# EAGLE design TelemetryECU rev1 (EAGLE 9.1.3)
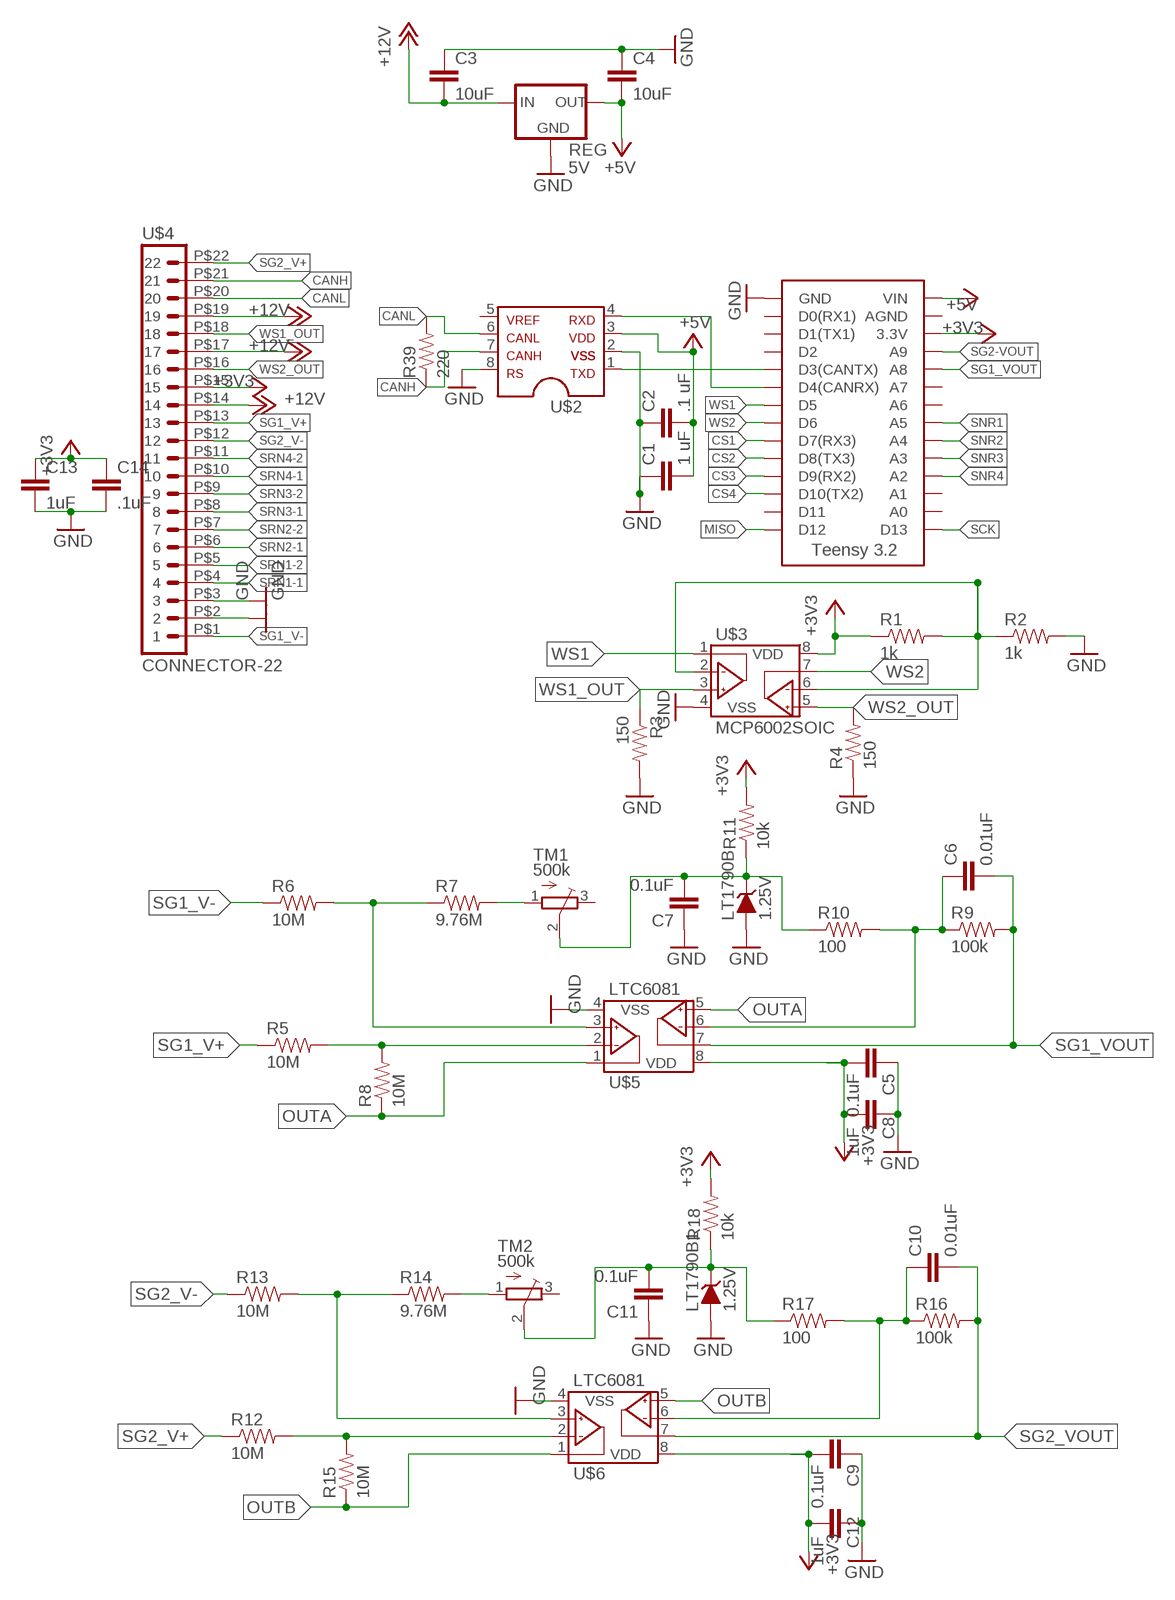
[diagram p0: schematic, sheet 1, part 1 of 2]
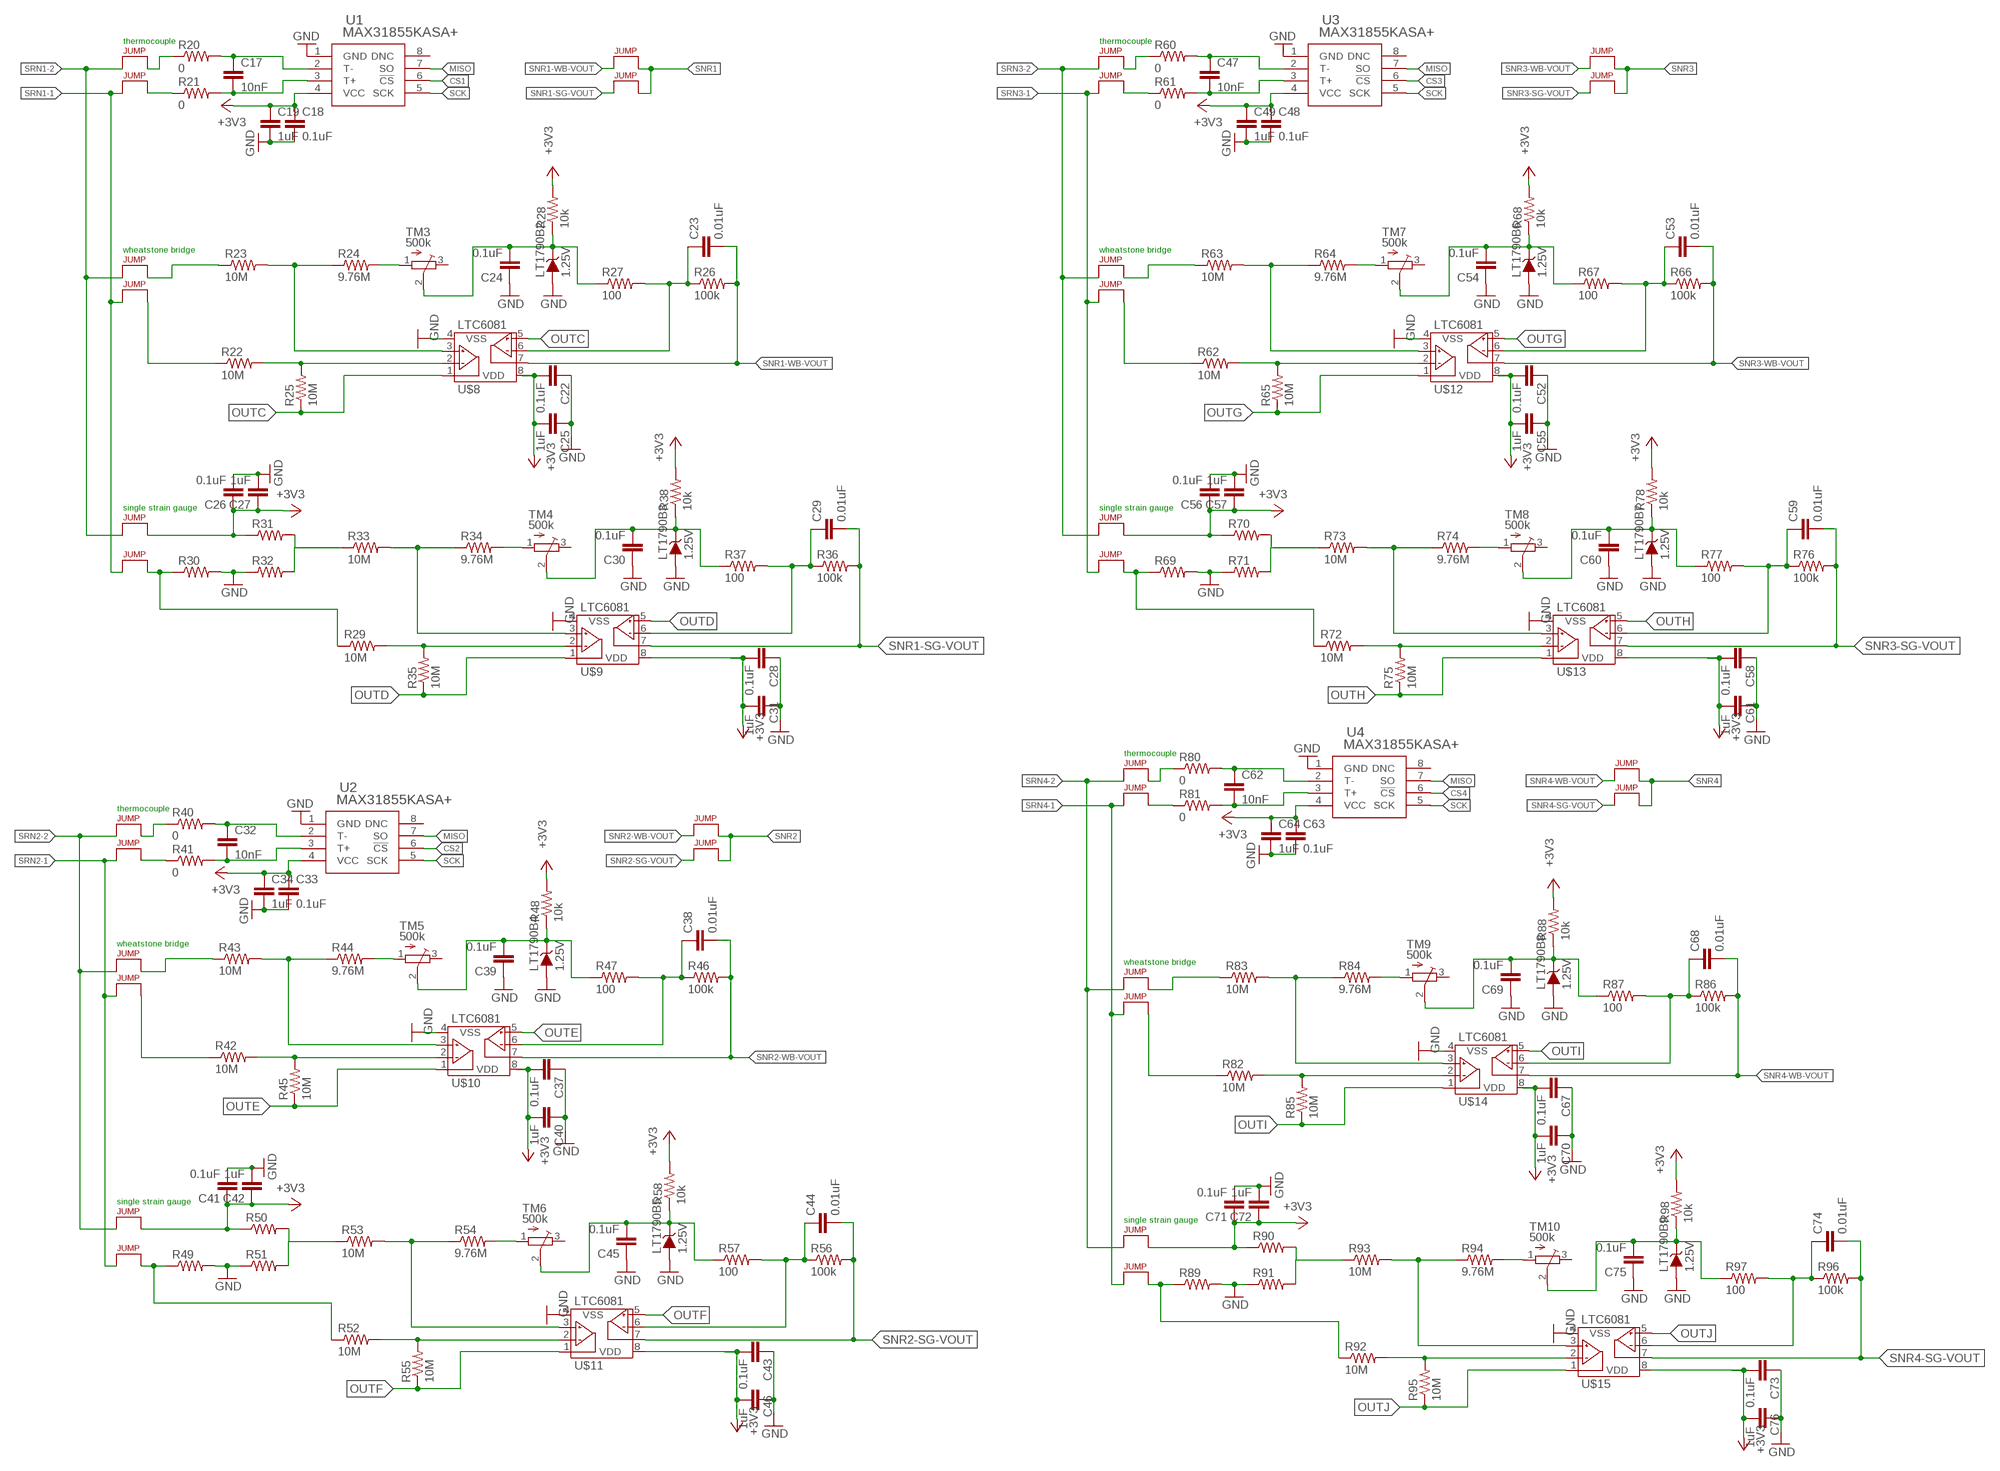
[diagram p1: schematic, sheet 1, part 2 of 2]

## Parts
C1  1 uF  CAP0603-CAP  [0603-CAP]
C2  .1 uF  CAP0603-CAP  [0603-CAP]
C3  10uF  CAP0603-CAP  [0603-CAP]
C4  10uF  CAP0603-CAP  [0603-CAP]
C5  0.1uF  CAP0603-CAP  [0603-CAP]
C6  0.01uF  CAP0603-CAP  [0603-CAP]
C7  0.1uF  CAP0603-CAP  [0603-CAP]
C8  1uF  CAP0603-CAP  [0603-CAP]
C9  0.1uF  CAP0603-CAP  [0603-CAP]
C10  0.01uF  CAP0603-CAP  [0603-CAP]
C11  0.1uF  CAP0603-CAP  [0603-CAP]
C12  1uF  CAP0603-CAP  [0603-CAP]
C13  1uF  CAP0603-CAP  [0603-CAP]
C14  .1uF  CAP0603-CAP  [0603-CAP]
C17  10nF  CAP0603-CAP  [0603-CAP]
C18  0.1uF  CAP0603-CAP  [0603-CAP]
C19  1uF  CAP0603-CAP  [0603-CAP]
C22  0.1uF  CAP0805  [0805]
C23  0.01uF  CAP0805  [0805]
C24  0.1uF  CAP0805  [0805]
C25  1uF  CAP0805  [0805]
C26  0.1uF  CAP0603-CAP  [0603-CAP]
C27  1uF  CAP0603-CAP  [0603-CAP]
C28  0.1uF  CAP0805  [0805]
C29  0.01uF  CAP0805  [0805]
C30  0.1uF  CAP0805  [0805]
C31  1uF  CAP0805  [0805]
C32  10nF  CAP0603-CAP  [0603-CAP]
C33  0.1uF  CAP0603-CAP  [0603-CAP]
C34  1uF  CAP0603-CAP  [0603-CAP]
C37  0.1uF  CAP0805  [0805]
C38  0.01uF  CAP0805  [0805]
C39  0.1uF  CAP0805  [0805]
C40  1uF  CAP0805  [0805]
C41  0.1uF  CAP0603-CAP  [0603-CAP]
C42  1uF  CAP0603-CAP  [0603-CAP]
C43  0.1uF  CAP0805  [0805]
C44  0.01uF  CAP0805  [0805]
C45  0.1uF  CAP0805  [0805]
C46  1uF  CAP0805  [0805]
C47  10nF  CAP0603-CAP  [0603-CAP]
C48  0.1uF  CAP0603-CAP  [0603-CAP]
C49  1uF  CAP0603-CAP  [0603-CAP]
C52  0.1uF  CAP0805  [0805]
C53  0.01uF  CAP0805  [0805]
C54  0.1uF  CAP0805  [0805]
C55  1uF  CAP0805  [0805]
C56  0.1uF  CAP0603-CAP  [0603-CAP]
C57  1uF  CAP0603-CAP  [0603-CAP]
C58  0.1uF  CAP0805  [0805]
C59  0.01uF  CAP0805  [0805]
C60  0.1uF  CAP0805  [0805]
C61  1uF  CAP0805  [0805]
C62  10nF  CAP0603-CAP  [0603-CAP]
C63  0.1uF  CAP0603-CAP  [0603-CAP]
C64  1uF  CAP0603-CAP  [0603-CAP]
C67  0.1uF  CAP0805  [0805]
C68  0.01uF  CAP0805  [0805]
C69  0.1uF  CAP0805  [0805]
C70  1uF  CAP0805  [0805]
C71  0.1uF  CAP0603-CAP  [0603-CAP]
C72  1uF  CAP0603-CAP  [0603-CAP]
C73  0.1uF  CAP0805  [0805]
C74  0.01uF  CAP0805  [0805]
C75  0.1uF  CAP0805  [0805]
C76  1uF  CAP0805  [0805]
J1  JUMPER.1  [1X02]
J2  JUMPER.1  [1X02]
J5  JUMPER.1  [1X02]
J6  JUMPER.1  [1X02]
J7  JUMPER.1  [1X02]
J8  JUMPER.1  [1X02]
J9  JUMPER.1  [1X02]
J10  JUMPER.1  [1X02]
J13  JUMPER.1  [1X02]
J14  JUMPER.1  [1X02]
J15  JUMPER.1  [1X02]
J16  JUMPER.1  [1X02]
J17  JUMPER.1  [1X02]
J18  JUMPER.1  [1X02]
J21  JUMPER.1  [1X02]
J22  JUMPER.1  [1X02]
J23  JUMPER.1  [1X02]
J24  JUMPER.1  [1X02]
J25  JUMPER.1  [1X02]
J26  JUMPER.1  [1X02]
J29  JUMPER.1  [1X02]
J30  JUMPER.1  [1X02]
J31  JUMPER.1  [1X02]
J32  JUMPER.1  [1X02]
J34  JUMPER.1  [1X02]
J35  JUMPER.1  [1X02]
J37  JUMPER.1  [1X02]
J38  JUMPER.1  [1X02]
J40  JUMPER.1  [1X02]
J41  JUMPER.1  [1X02]
J42  JUMPER.1  [1X02]
J43  JUMPER.1  [1X02]
LT1790B  1.25V  DIODE_ZENER0805  [0805_D]
LT1790B1  1.25V  DIODE_ZENER0805  [0805_D]
LT1790B2  1.25V  DIODE_ZENER0805  [0805_D]
LT1790B3  1.25V  DIODE_ZENER0805  [0805_D]
LT1790B4  1.25V  DIODE_ZENER0805  [0805_D]
LT1790B5  1.25V  DIODE_ZENER0805  [0805_D]
LT1790B6  1.25V  DIODE_ZENER0805  [0805_D]
LT1790B7  1.25V  DIODE_ZENER0805  [0805_D]
LT1790B8  1.25V  DIODE_ZENER0805  [0805_D]
LT1790B9  1.25V  DIODE_ZENER0805  [0805_D]
R1  1k  RESISTOR0603-RES  [0603-RES]
R2  1k  RESISTOR0603-RES  [0603-RES]
R3  150  RESISTOR0603-RES  [0603-RES]
R4  150  RESISTOR0603-RES  [0603-RES]
R5  10M  RESISTOR0603-RES  [0603-RES]
R6  10M  RESISTOR0603-RES  [0603-RES]
R7  9.76M  RESISTOR0603-RES  [0603-RES]
R8  10M  RESISTOR0603-RES  [0603-RES]
R9  100k  RESISTOR0603-RES  [0603-RES]
R10  100  RESISTOR0603-RES  [0603-RES]
R11  10k  RESISTOR0603  [0603-RES]
R12  10M  RESISTOR0603-RES  [0603-RES]
R13  10M  RESISTOR0603-RES  [0603-RES]
R14  9.76M  RESISTOR0603-RES  [0603-RES]
R15  10M  RESISTOR0603-RES  [0603-RES]
R16  100k  RESISTOR0603-RES  [0603-RES]
R17  100  RESISTOR0603-RES  [0603-RES]
R18  10k  RESISTOR0603-RES  [0603-RES]
R20  0  RESISTOR0603  [0603-RES]
R21  0  RESISTOR0603  [0603-RES]
R22  10M  RESISTOR0805-RES  [0805]
R23  10M  RESISTOR0805-RES  [0805]
R24  9.76M  RESISTOR0805-RES  [0805]
R25  10M  RESISTOR0805-RES  [0805]
R26  100k  RESISTOR0805-RES  [0805]
R27  100  RESISTOR0805-RES  [0805]
R28  10k  RESISTOR0805-RES  [0805]
R29  10M  RESISTOR0805-RES  [0805]
R30  RESISTOR0603  [0603-RES]
R31  RESISTOR0603  [0603-RES]
R32  RESISTOR0603  [0603-RES]
R33  10M  RESISTOR0805-RES  [0805]
R34  9.76M  RESISTOR0805-RES  [0805]
R35  10M  RESISTOR0805-RES  [0805]
R36  100k  RESISTOR0805-RES  [0805]
R37  100  RESISTOR0805-RES  [0805]
R38  10k  RESISTOR0805-RES  [0805]
R39  220  RESISTOR0603-RES  [0603-RES]
R40  0  RESISTOR0603  [0603-RES]
R41  0  RESISTOR0603  [0603-RES]
R42  10M  RESISTOR0805-RES  [0805]
R43  10M  RESISTOR0805-RES  [0805]
R44  9.76M  RESISTOR0805-RES  [0805]
R45  10M  RESISTOR0805-RES  [0805]
R46  100k  RESISTOR0805-RES  [0805]
R47  100  RESISTOR0805-RES  [0805]
R48  10k  RESISTOR0805-RES  [0805]
R49  RESISTOR0603  [0603-RES]
R50  RESISTOR0603  [0603-RES]
R51  RESISTOR0603  [0603-RES]
R52  10M  RESISTOR0805-RES  [0805]
R53  10M  RESISTOR0805-RES  [0805]
R54  9.76M  RESISTOR0805-RES  [0805]
R55  10M  RESISTOR0805-RES  [0805]
R56  100k  RESISTOR0805-RES  [0805]
R57  100  RESISTOR0805-RES  [0805]
R58  10k  RESISTOR0805-RES  [0805]
R60  0  RESISTOR0603  [0603-RES]
R61  0  RESISTOR0603  [0603-RES]
R62  10M  RESISTOR0805-RES  [0805]
R63  10M  RESISTOR0805-RES  [0805]
R64  9.76M  RESISTOR0805-RES  [0805]
R65  10M  RESISTOR0805-RES  [0805]
R66  100k  RESISTOR0805-RES  [0805]
R67  100  RESISTOR0805-RES  [0805]
R68  10k  RESISTOR0805-RES  [0805]
R69  RESISTOR0603  [0603-RES]
R70  RESISTOR0603  [0603-RES]
R71  RESISTOR0603  [0603-RES]
R72  10M  RESISTOR0805-RES  [0805]
R73  10M  RESISTOR0805-RES  [0805]
R74  9.76M  RESISTOR0805-RES  [0805]
R75  10M  RESISTOR0805-RES  [0805]
R76  100k  RESISTOR0805-RES  [0805]
R77  100  RESISTOR0805-RES  [0805]
R78  10k  RESISTOR0805-RES  [0805]
R80  0  RESISTOR0603  [0603-RES]
R81  0  RESISTOR0603  [0603-RES]
R82  10M  RESISTOR0805-RES  [0805]
R83  10M  RESISTOR0805-RES  [0805]
R84  9.76M  RESISTOR0805-RES  [0805]
R85  10M  RESISTOR0805-RES  [0805]
R86  100k  RESISTOR0805-RES  [0805]
R87  100  RESISTOR0805-RES  [0805]
R88  10k  RESISTOR0805-RES  [0805]
R89  RESISTOR0603  [0603-RES]
R90  RESISTOR0603  [0603-RES]
R91  RESISTOR0603  [0603-RES]
R92  10M  RESISTOR0805-RES  [0805]
R93  10M  RESISTOR0805-RES  [0805]
R94  9.76M  RESISTOR0805-RES  [0805]
R95  10M  RESISTOR0805-RES  [0805]
R96  100k  RESISTOR0805-RES  [0805]
R97  100  RESISTOR0805-RES  [0805]
R98  10k  RESISTOR0805-RES  [0805]
REG  5V  OKI-78SR-5  [OKI-78SR]
TM1  500k  TRIMPOTTC33X  [TC33X]
TM2  500k  TRIMPOTTC33X  [TC33X]
TM3  500k  TRIMPOTTC33X  [TC33X]
TM4  500k  TRIMPOTTC33X  [TC33X]
TM5  500k  TRIMPOTTC33X  [TC33X]
TM6  500k  TRIMPOTTC33X  [TC33X]
TM7  500k  TRIMPOTTC33X  [TC33X]
TM8  500k  TRIMPOTTC33X  [TC33X]
TM9  500k  TRIMPOTTC33X  [TC33X]
TM10  500k  TRIMPOTTC33X  [TC33X]
U1  MAX31855KASA+  [21-0041B_8]
U2  MAX31855KASA+  [21-0041B_8]
U3  MAX31855KASA+  [21-0041B_8]
U4  MAX31855KASA+  [21-0041B_8]
U$1  TEENSY_3.2_SIMPLE  [TEENSY_3.2_SIMPLE]
U$2  MCP2551  [SOIC-08]
U$3  MCP6002SOIC  [SOIC-08]
U$4  CONNECTOR-22  [AUTOSPORT_12-35]
U$5  LTC6081  [MSOP-8_MS]
U$6  LTC6081  [MSOP-8_MS]
U$8  LTC6081  [MSOP-8_MS]
U$9  LTC6081  [MSOP-8_MS]
U$10  LTC6081  [MSOP-8_MS]
U$11  LTC6081  [MSOP-8_MS]
U$12  LTC6081  [MSOP-8_MS]
U$13  LTC6081  [MSOP-8_MS]
U$14  LTC6081  [MSOP-8_MS]
U$15  LTC6081  [MSOP-8_MS]

## Nets
+3V3: C5.2 C8.1 C9.2 C12.1 C13.1 C14.1 C18.1 C19.1 C22.2 C25.2 C26.1 C27.1 C28.2 C31.1 C33.1 C34.1 C37.2 C40.2 C41.1 C42.1 C43.2 C46.1 C48.1 C49.1 C52.2 C55.2 C56.1 C57.1 C58.2 C61.1 C63.1 C64.1 C67.2 C70.2 C71.1 C72.1 C73.2 C76.1 J7.2 J15.2 J23.2 J31.2 R1.1 R11.2 R18.2 R28.2 R31.1 R38.2 R48.2 R50.1 R58.2 R68.2 R70.1 R78.2 R88.2 R90.1 R98.2 U1.4(VCC) U2.4(VCC) U3.4(VCC) U4.4(VCC) U$1.3.3V U$3.8(VDD) U$4.P$15 U$5.8(VDD) U$6.8(VDD) U$8.8(VDD) U$9.8(VDD) U$10.8(VDD) U$11.8(VDD) U$12.8(VDD) U$13.8(VDD) U$14.8(VDD) U$15.8(VDD)
+5V: C1.2 C2.2 C4.2 REG.3(OUT) U$1.VIN U$2.3
+12V: C3.2 REG.1(IN) U$4.P$14 U$4.P$17 U$4.P$19
CANH: R39.1 U$2.7 U$4.P$21
CANL: R39.2 U$2.6 U$4.P$20
CS1: U1.6(!CS) U$1.D7(RX3)
CS2: U2.6(!CS) U$1.D8(TX3)
CS3: U3.6(!CS) U$1.D9(RX2)
CS4: U4.6(!CS) U$1.D10(TX2)
GND: C1.1 C2.1 C3.1 C4.1 C5.1 C7.1 C8.2 C9.1 C11.1 C12.2 C13.2 C14.2 C18.2 C19.2 C22.1 C24.1 C25.1 C26.2 C27.2 C28.1 C30.1 C31.2 C33.2 C34.2 C37.1 C39.1 C40.1 C41.2 C42.2 C43.1 C45.1 C46.2 C48.2 C49.2 C52.1 C54.1 C55.1 C56.2 C57.2 C58.1 C60.1 C61.2 C63.2 C64.2 C67.1 C69.1 C70.1 C71.2 C72.2 C73.1 C75.1 C76.2 LT1790B1.A LT1790B2.A LT1790B3.A LT1790B4.A LT1790B5.A LT1790B6.A LT1790B7.A LT1790B8.A LT1790B9.A LT1790B.A R2.2 R3.2 R4.1 R30.2 R32.1 R49.2 R51.1 R69.2 R71.1 R89.2 R91.1 REG.2(GND) U1.1(GND) U2.1(GND) U3.1(GND) U4.1(GND) U$1.GND U$2.2 U$2.8 U$3.4(VSS) U$4.P$2 U$4.P$3 U$5.4(VSS) U$6.4(VSS) U$8.4(VSS) U$9.4(VSS) U$10.4(VSS) U$11.4(VSS) U$12.4(VSS) U$13.4(VSS) U$14.4(VSS) U$15.4(VSS)
INB-: C6.1 R9.1 R10.2 U$5.6(VINB-)
INB-1: C10.1 R16.1 R17.2 U$6.6(VINB-)
INB-2: C23.1 R26.1 R27.2 U$8.6(VINB-)
INB-3: C29.1 R36.1 R37.2 U$9.6(VINB-)
INB-4: C38.1 R46.1 R47.2 U$10.6(VINB-)
INB-5: C44.1 R56.1 R57.2 U$11.6(VINB-)
INB-6: C53.1 R66.1 R67.2 U$12.6(VINB-)
INB-7: C59.1 R76.1 R77.2 U$13.6(VINB-)
INB-8: C68.1 R86.1 R87.2 U$14.6(VINB-)
INB-9: C74.1 R96.1 R97.2 U$15.6(VINB-)
MISO: U1.7(SO) U2.7(SO) U3.7(SO) U4.7(SO) U$1.D12
N$1: U$1.D4(CANRX) U$2.4
N$2: C17.1 R20.2 U1.2(T-)
N$3: U$1.D3(CANTX) U$2.1
N$4: R1.2 R2.1 U$3.2(VINA-) U$3.6(VINB-)
N$5: R5.2 R8.2 U$5.2(VINA-)
N$6: C17.2 R21.2 U1.3(T+)
N$7: J2.2 R21.1
N$8: R6.2 R7.1 U$5.3(VINA+)
N$9: C7.2 LT1790B.C R10.1 R11.1 TM1.2(S)
N$10: R7.2 TM1.1(A)
N$11: R12.2 R15.2 U$6.2(VINA-)
N$12: R13.2 R14.1 U$6.3(VINA+)
N$13: C11.2 LT1790B1.C R17.1 R18.1 TM2.2(S)
N$14: R14.2 TM2.1(A)
N$15: J1.2 R20.1
N$16: R22.2 R25.2 U$8.2(VINA-)
N$17: R23.2 R24.1 U$8.3(VINA+)
N$18: C24.2 LT1790B2.C R27.1 R28.1 TM3.2(S)
N$19: R24.2 TM3.1(A)
N$21: J6.2 R22.1
N$22: R31.2 R32.2 R33.1
N$23: J8.2 R29.1 R30.1
N$24: C32.1 R40.2 U2.2(T-)
N$25: J5.2 R23.1
N$26: R29.2 R35.2 U$9.2(VINA-)
N$27: R33.2 R34.1 U$9.3(VINA+)
N$28: C30.2 LT1790B3.C R37.1 R38.1 TM4.2(S)
N$29: R34.2 TM4.1(A)
N$30: C32.2 R41.2 U2.3(T+)
N$31: J10.2 R41.1
N$32: J9.2 R40.1
N$33: R42.2 R45.2 U$10.2(VINA-)
N$34: R43.2 R44.1 U$10.3(VINA+)
N$35: C39.2 LT1790B4.C R47.1 R48.1 TM5.2(S)
N$36: R44.2 TM5.1(A)
N$37: R50.2 R51.2 R53.1
N$38: J16.2 R49.1 R52.1
N$39: J14.2 R42.1
N$40: J13.2 R43.1
N$41: R52.2 R55.2 U$11.2(VINA-)
N$42: R53.2 R54.1 U$11.3(VINA+)
N$43: C45.2 LT1790B5.C R57.1 R58.1 TM6.2(S)
N$44: R54.2 TM6.1(A)
N$45: C47.1 R60.2 U3.2(T-)
N$46: C47.2 R61.2 U3.3(T+)
N$47: J18.2 R61.1
N$48: J17.2 R60.1
N$49: R62.2 R65.2 U$12.2(VINA-)
N$50: R63.2 R64.1 U$12.3(VINA+)
N$51: C54.2 LT1790B6.C R67.1 R68.1 TM7.2(S)
N$52: R64.2 TM7.1(A)
N$53: R70.2 R71.2 R73.1
N$54: J24.2 R69.1 R72.1
N$55: J22.2 R62.1
N$56: J21.2 R63.1
N$57: R72.2 R75.2 U$13.2(VINA-)
N$58: R73.2 R74.1 U$13.3(VINA+)
N$59: C60.2 LT1790B7.C R77.1 R78.1 TM8.2(S)
N$60: R74.2 TM8.1(A)
N$61: C62.1 R80.2 U4.2(T-)
N$62: C62.2 R81.2 U4.3(T+)
N$63: J26.2 R81.1
N$64: J25.2 R80.1
N$65: R82.2 R85.2 U$14.2(VINA-)
N$66: R83.2 R84.1 U$14.3(VINA+)
N$67: C69.2 LT1790B8.C R87.1 R88.1 TM9.2(S)
N$68: R84.2 TM9.1(A)
N$69: R90.2 R91.2 R93.1
N$70: J32.2 R89.1 R92.1
N$71: J30.2 R82.1
N$72: J29.2 R83.1
N$73: R92.2 R95.2 U$15.2(VINA-)
N$74: R93.2 R94.1 U$15.3(VINA+)
N$75: C75.2 LT1790B9.C R97.1 R98.1 TM10.2(S)
N$76: R94.2 TM10.1(A)
OUTA: R8.1 U$5.1(VOUTA) U$5.5(VINB+)
OUTB: R15.1 U$6.1(VOUTA) U$6.5(VINB+)
OUTC: R25.1 U$8.1(VOUTA) U$8.5(VINB+)
OUTD: R35.1 U$9.1(VOUTA) U$9.5(VINB+)
OUTE: R45.1 U$10.1(VOUTA) U$10.5(VINB+)
OUTF: R55.1 U$11.1(VOUTA) U$11.5(VINB+)
OUTG: R65.1 U$12.1(VOUTA) U$12.5(VINB+)
OUTH: R75.1 U$13.1(VOUTA) U$13.5(VINB+)
OUTI: R85.1 U$14.1(VOUTA) U$14.5(VINB+)
OUTJ: R95.1 U$15.1(VOUTA) U$15.5(VINB+)
SCK: U1.5(SCK) U2.5(SCK) U3.5(SCK) U4.5(SCK) U$1.D13
SG1_V+: R5.1 U$4.P$13
SG1_V-: R6.1 U$4.P$1
SG1_VOUT: C6.2 R9.2 U$1.A8 U$5.7(VOUTB)
SG2-VOUT: U$1.A9
SG2_V+: R12.1 U$4.P$22
SG2_V-: R13.1 U$4.P$12
SG2_VOUT: C10.2 R16.2 U$6.7(VOUTB)
SNR1: J34.2 J35.2 U$1.A5
SNR1-SG-VOUT: C29.2 J35.1 R36.2 U$9.7(VOUTB)
SNR1-WB-VOUT: C23.2 J34.1 R26.2 U$8.7(VOUTB)
SNR2: J42.2 J43.2 U$1.A4
SNR2-SG-VOUT: C44.2 J42.1 R56.2 U$11.7(VOUTB)
SNR2-WB-VOUT: C38.2 J43.1 R46.2 U$10.7(VOUTB)
SNR3: J37.2 J38.2 U$1.A3
SNR3-SG-VOUT: C59.2 J38.1 R76.2 U$13.7(VOUTB)
SNR3-WB-VOUT: C53.2 J37.1 R66.2 U$12.7(VOUTB)
SNR4: J40.2 J41.2 U$1.A2
SNR4-SG-VOUT: C74.2 J41.1 R96.2 U$15.7(VOUTB)
SNR4-WB-VOUT: C68.2 J40.1 R86.2 U$14.7(VOUTB)
SRN1-1: J2.1 J6.1 J8.1 U$4.P$4
SRN1-2: J1.1 J5.1 J7.1 U$4.P$5
SRN2-1: J10.1 J14.1 J16.1 U$4.P$6
SRN2-2: J9.1 J13.1 J15.1 U$4.P$7
SRN3-1: J18.1 J22.1 J24.1 U$4.P$8
SRN3-2: J17.1 J21.1 J23.1 U$4.P$9
SRN4-1: J26.1 J30.1 J32.1 U$4.P$10
SRN4-2: J25.1 J29.1 J31.1 U$4.P$11
WS1: U$1.D5 U$3.1(VOUTA)
WS1_OUT: R3.1 U$3.3(VINA+) U$4.P$18
WS2: U$1.D6 U$3.7(VOUTB)
WS2_OUT: R4.2 U$3.5(VINB+) U$4.P$16
Unconnected: TM1.3(E) TM2.3(E) TM3.3(E) TM4.3(E) TM5.3(E) TM6.3(E) TM7.3(E) TM8.3(E) TM9.3(E) TM10.3(E) U1.8(DNC) U2.8(DNC) U3.8(DNC) U4.8(DNC) U$1.A0 U$1.A1 U$1.A6 U$1.A7 U$1.AGND U$1.D0(RX1) U$1.D1(TX1) U$1.D2 U$1.D11 U$2.5

## Notes on the sheet
- thermocouple | thermocouple
- wheatstone bridge | wheatstone bridge
- single strain gauge | single strain gauge
- thermocouple
- thermocouple
- wheatstone bridge
- wheatstone bridge
- single strain gauge
- single strain gauge

## Library data of the parts
C1-C14 C17-C19 C22-C34 C37-C49 C52-C64 C67-C76 = HyTechDevices:CAP: Capacitor Standard 0603 ceramic capacitor, and 0.1" leaded capacitor.
J1 J2 J5-J10 J13-J18 J21-J26 J29-J32 J34 J35 J37 J38 J40-J43 = HyTechDevices:JUMPER: Jumper for changing operation of a device
LT1790B LT1790B1-LT1790B9 = HyTechDevices:DIODE_ZENER: ZENER DIODE
R1-R18 R20-R58 R60-R78 R80-R98 = HyTechDevices:RESISTOR: Resistor Basic schematic elements and footprints for 0603, 1206, and PTH resistors.
REG = HyTechDevices:OKI-78SR-5: Murata OKI-78SR 5V 1.5A Non-Isolated Switching Regulator DC/DC - Datasheet <https://power.murata.com/data/power/oki-78sr.pdf>
TM1-TM10 = HyTechDevices:TRIMPOT: SMT trimmer potentiometer part number TC33X http://www.ladyada.net/library/eagle
U1-U4 = HyTechDevices:MAX31855KASA+; MANUFACTURER_PART_NUMBER: MAX31855KASA+; VENDOR: Maxim Integrated Products
U$1 = HyTechDevices:TEENSY_3.2_SIMPLE: Simple version of the Teensy 3.2 board that only uses the 2 main rows of pins, with no perpendicular row with VBat or inner pins.
U$2 = HyTechDevices:MCP2551: MCP2551 High-Speed CAN Transceiver Product Webpage <https://www.microchip.com/wwwproducts/en/MCP2551> Datasheet <http://ww1.microchip.com/downloads/en/DeviceDoc/21667f.pdf> This device is outdated It is replaced by MCP2561. Comparison Page <https://www.microchip.com/wwwproducts/ProductCompare/MCP2551/MCP2561> Product Webpage <https://www.microchip.com/wwwproducts/en/MCP2561> Datasheet <http://ww1.microchip.com/downloads/en/DeviceDoc/20005167C.pdf>
U$3 = HyTechDevices:MCP6002: Microchip MCP6002 Dual Channel Op Amp
U$4 = HyTechDevices:CONNECTOR-22
U$5 U$6 U$8-U$15 = HyTechDevices:LTC6081

## Board
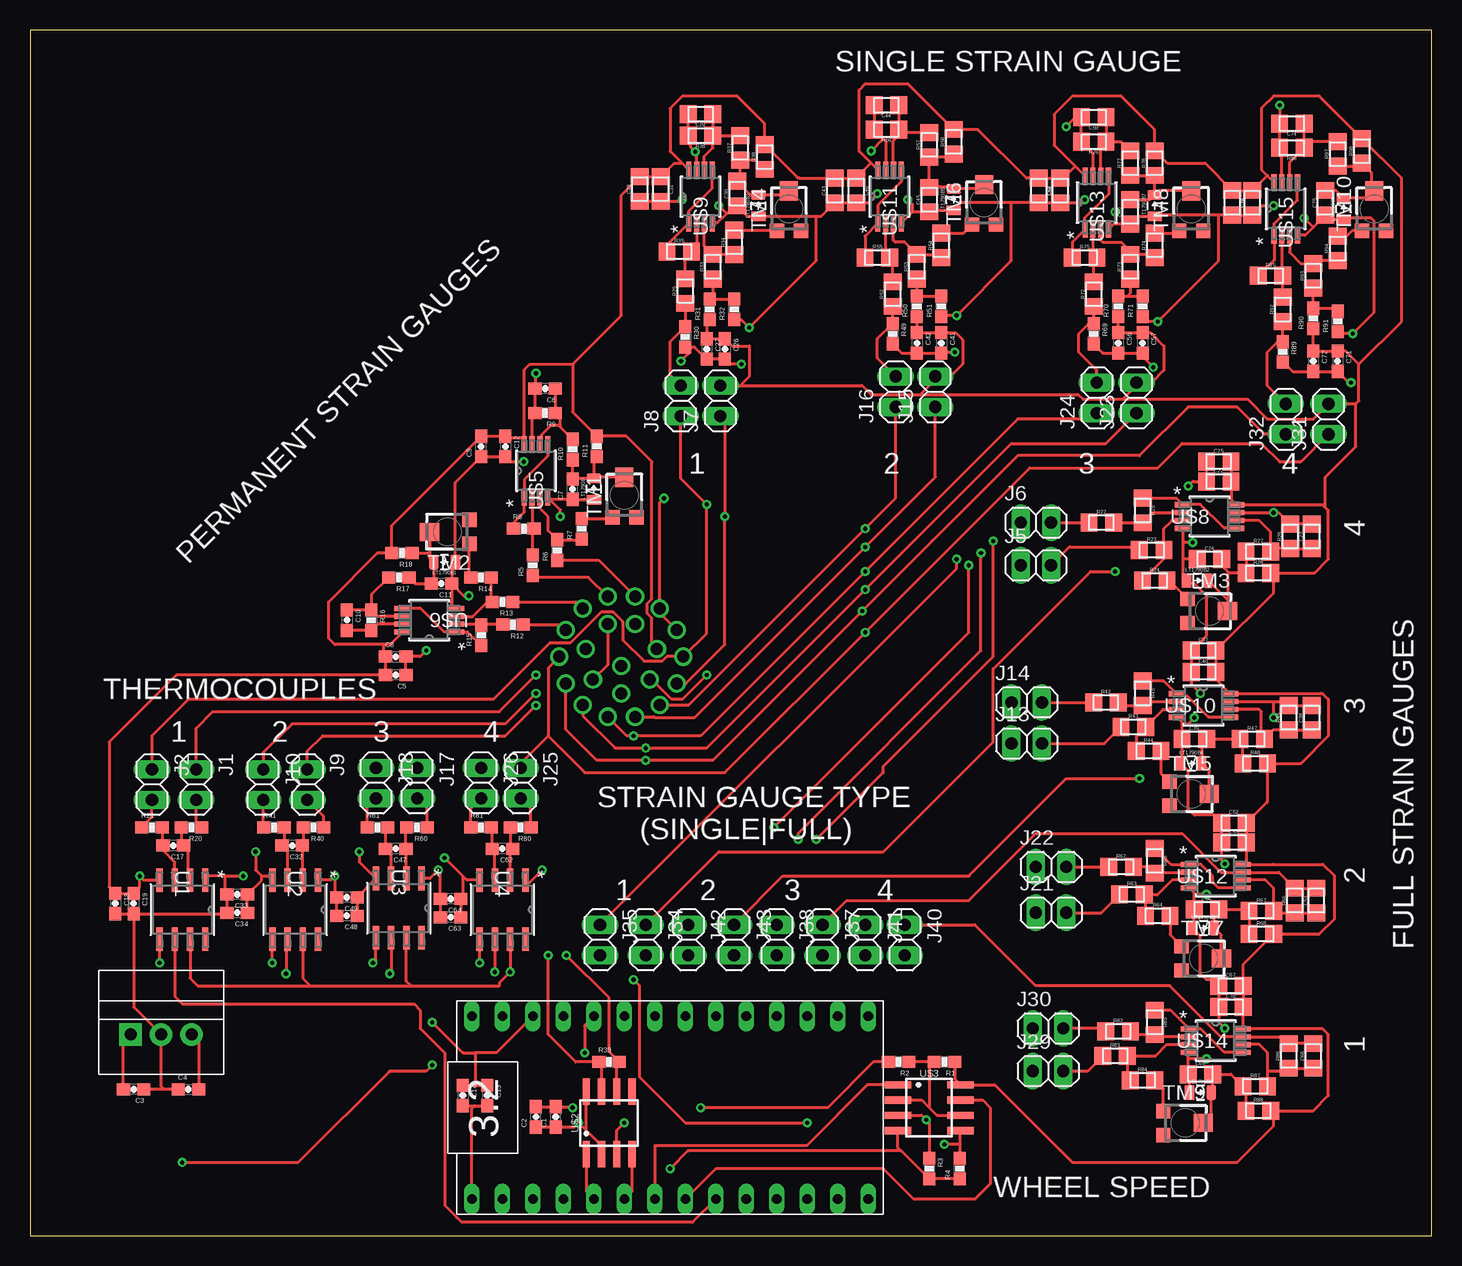
[diagram p2: board, top side]
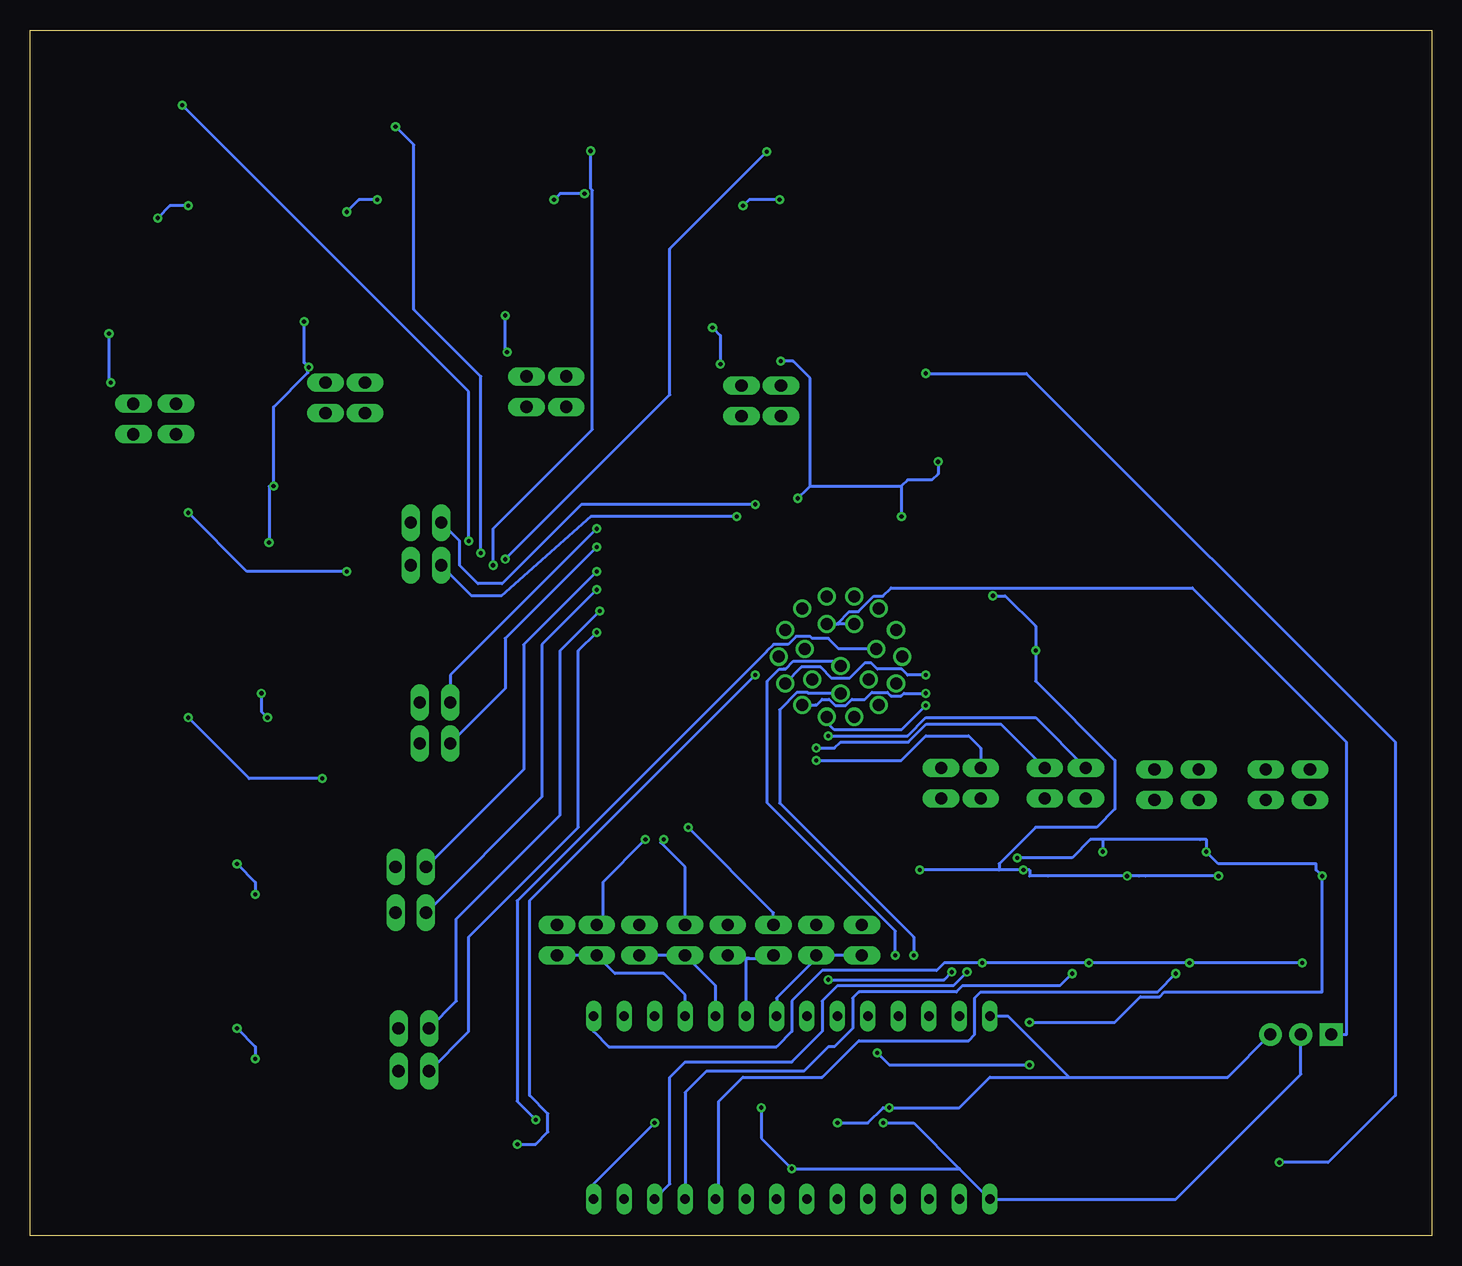
[diagram p3: board, bottom side, seen from below]

Size 116.82 x 100.51 mm. Coordinates in mm from the lower left corner, seen from the top.
Outline: 0,0 116.82,0 116.82,100.51 0,100.51 0,0
Copper layers (1*16): Top 0.035mm / dielectric 1.5mm / Bottom 0.035mm
Design rules "default": minimum track width 6mil, minimum drill 0.35mm, track to track 6mil, track to pad 6mil, pad to pad 6mil, via to via 6mil, smd to smd 6mil, copper to edge 40mil, drill to drill 6mil, minimum pad ring 10mil, minimum via ring 8mil, stop-mask expansion 4mil, vias tented up to drill 0mil, thermal gap 10mil

### Footprints (pad centres in the part's own frame; a part is rotated, then mirrored left to right if it is on the bottom)
0603-CAP = smd 1.1 x 1: 1 -0.85,0; 2 0.85,0
0805 = smd 1.4 x 1.5: 1 -1.025,0; 2 1.025,0
1X02 = drill 1.016 long: 1 -1.27,0; 2 1.27,0
0805_D = smd 0.8 x 1.2: A -0.9,0; C 0.9,0
0603-RES = smd 1.1 x 1: 1 -0.85,0; 2 0.85,0
OKI-78SR = drill 1 pad 1.88 square: 1 -2.54,0 | drill 1 pad 1.88: 2 0,0; 3 2.54,0
TC33X = smd 1.2 x 1.2: 1 -1,-1.825; 3 1,-1.825 | smd 1.5 x 1.6: 2 0,1.5
21-0041B_8 = smd 1.981 x 0.533: 1 -2.464,1.905; 2 -2.464,0.635; 3 -2.464,-0.635; 4 -2.464,-1.905; 5 2.464,-1.905; 6 2.464,-0.635; 7 2.464,0.635; 8 2.464,1.905
TEENSY_3.2_SIMPLE = drill 0.8 long: 3.3V 16.51,29.21; A0 16.51,3.81; A1 16.51,6.35; A2 16.51,8.89; A3 16.51,11.43; A4 16.51,13.97; A5 16.51,16.51; A6 16.51,19.05; A7 16.51,21.59; A8 16.51,24.13; A9 16.51,26.67; AGND 16.51,31.75; D0(RX1) 1.27,31.75; D1(TX1) 1.27,29.21; D2 1.27,26.67; D3(CANTX) 1.27,24.13; D4(CANRX) 1.27,21.59; D5 1.27,19.05; D6 1.27,16.51; D7(RX3) 1.27,13.97; D8(TX3) 1.27,11.43; D9(RX2) 1.27,8.89; D10(TX2) 1.27,6.35; D11 1.27,3.81; D12 1.27,1.27; D13 16.51,1.27; GND 1.27,34.29; VIN 16.51,34.29
SOIC-08 = smd 0.6 x 2.2: 1 -1.905,-2.6; 2 -0.635,-2.6; 3 0.635,-2.6; 4 1.905,-2.6; 5 1.905,2.6; 6 0.635,2.6; 7 -0.635,2.6; 8 -1.905,2.6
AUTOSPORT_12-35 = drill 1: P$1 1.143,5.004; P$2 3.2,4.013; P$3 4.623,2.235; P$4 5.156,0; P$5 4.623,-2.235; P$6 3.2,-4.013; P$7 1.143,-5.004; P$8 -1.143,-5.004; P$9 -3.2,-4.013; P$10 -4.623,-2.235; P$11 -5.156,0; P$12 -3.2,4.013; P$13 -1.143,5.004; P$14 1.143,2.718; P$15 2.972,0.66; P$16 2.362,-1.905; P$17 -2.362,-1.905; P$18 -2.972,0.66; P$19 -1.143,2.718; P$20 0,-0.762; P$21 0,-3.048; P$22 -4.623,2.235
MSOP-8_MS = smd 1.397 x 0.432: 1 -2.21,0.975; 2 -2.21,0.325; 3 -2.21,-0.325; 4 -2.21,-0.975; 5 2.21,-0.975; 6 2.21,-0.325; 7 2.21,0.325; 8 2.21,0.975

### Placement (x,y rotation side)
C1  43.81,9.91 90 top
C2  42.16,9.91 90 top
C3  8.64,12.19 180 top
C4  13.21,12.19 0 top
C5  30.48,46.74 180 top
C6  42.93,70.61 180 top
C7  45.21,62.23 90 top
C8  30.48,48.26 0 top
C9  37.59,65.79 90 top
C10  26.42,51.31 270 top
C11  34.29,54.36 180 top
C12  39.62,65.79 270 top
C13  38.1,11.68 270 top
C14  36.07,11.68 270 top
C17  11.94,32.51 180 top
C18  7.11,27.69 270 top
C19  8.64,27.69 270 top
C22  99.06,62.87 0 top
C23  106.81,58.29 90 top
C24  98.3,56.39 0 top
C25  99.06,64.52 0 top
C26  57.91,73.91 270 top
C27  56.39,73.91 270 top
C28  50.8,87.25 90 top
C29  55.88,93.47 180 top
C30  58.93,86.87 90 top
C31  52.58,87.25 270 top
C32  21.84,32.51 180 top
C33  17.27,28.45 180 top
C34  17.27,26.92 180 top
C37  97.79,48.77 0 top
C38  106.81,43.18 90 top
C39  97.03,41.4 0 top
C40  97.79,46.99 0 top
C41  75.95,74.42 270 top
C42  73.91,74.42 270 top
C43  67.06,87.12 90 top
C44  71.37,94.23 180 top
C45  74.93,86.36 90 top
C46  68.83,87.12 270 top
C47  30.48,32.26 180 top
C48  26.42,26.67 180 top
C49  26.42,28.19 180 top
C52  100.33,34.42 0 top
C53  107.19,27.94 90 top
C54  98.04,27.18 0 top
C55  100.33,32.77 0 top
C56  90.68,74.42 270 top
C57  92.71,74.42 270 top
C58  85.85,87.12 90 top
C59  88.65,93.22 180 top
C60  91.69,85.34 90 top
C61  84.07,87.12 270 top
C62  39.37,32.26 180 top
C63  35.05,26.54 180 top
C64  35.05,28.07 180 top
C67  100.08,20.83 0 top
C68  106.93,14.99 90 top
C69  97.54,13.46 0 top
C70  100.08,19.05 0 top
C71  108.97,72.9 270 top
C72  106.93,72.9 270 top
C73  101.85,86.11 90 top
C74  105.16,92.71 180 top
C75  107.95,86.11 90 top
C76  100.2,86.11 270 top
J1  13.84,37.59 270 top
J2  10.16,37.59 270 top
J5  83.82,55.88 0 top
J6  83.82,59.44 0 top
J7  57.53,69.6 90 top
J8  54.23,69.6 90 top
J9  23.11,37.59 270 top
J10  19.43,37.59 270 top
J13  83.06,41.02 0 top
J14  83.06,44.45 0 top
J15  75.44,70.36 90 top
J16  72.14,70.36 90 top
J17  32.26,37.72 270 top
J18  28.83,37.72 270 top
J21  85.09,26.92 0 top
J22  85.09,30.73 0 top
J23  92.2,69.85 90 top
J24  88.9,69.85 90 top
J25  40.89,37.72 270 top
J26  37.59,37.72 270 top
J29  84.84,13.72 0 top
J30  84.84,17.27 0 top
J31  108.2,68.07 90 top
J32  104.65,68.07 90 top
J34  51.31,24.64 270 top
J35  47.5,24.64 270 top
J37  66.04,24.64 270 top
J38  62.23,24.64 270 top
J40  72.9,24.64 270 top
J41  69.6,24.64 270 top
J42  54.86,24.64 270 top
J43  58.67,24.64 270 top
LT1790B  46.99,62.23 90 top
LT1790B1  34.54,56.13 180 top
LT1790B2  97.28,54.61 0 top
LT1790B3  60.71,85.85 90 top
LT1790B4  96.77,39.37 0 top
LT1790B5  76.96,86.36 90 top
LT1790B6  97.79,25.65 0 top
LT1790B7  93.73,85.85 90 top
LT1790B8  97.54,11.94 0 top
LT1790B9  109.47,85.6 90 top
R1  76.2,14.48 180 top
R2  72.39,14.48 180 top
R3  74.93,5.59 270 top
R4  77.47,5.59 90 top
R5  41.91,55.88 90 top
R6  43.94,57.15 90 top
R7  45.97,58.93 90 top
R8  41.15,58.93 0 top
R9  42.93,68.58 180 top
R10  45.21,65.53 90 top
R11  47.24,65.79 90 top
R12  40.26,50.93 180 top
R13  39.37,52.83 180 top
R14  37.59,54.86 180 top
R15  37.59,50.04 90 top
R16  28.45,51.31 270 top
R17  30.73,54.86 180 top
R18  30.99,56.9 180 top
R20  13.46,34.04 180 top
R21  10.16,34.04 0 top
R22  89.28,59.44 0 top
R23  93.47,57.15 0 top
R24  93.73,54.61 0 top
R25  92.71,60.45 270 top
R26  105.03,58.29 90 top
R27  102.36,57.02 0 top
R28  102.36,55.25 0 top
R29  54.61,78.74 90 top
R30  54.61,74.93 270 top
R31  56.64,77.22 90 top
R32  58.67,77.22 90 top
R33  56.9,80.77 90 top
R34  58.67,82.8 90 top
R35  54.1,82.04 0 top
R36  55.88,91.69 180 top
R37  59.18,90.68 90 top
R38  61.21,89.92 90 top
R39  48.26,14.48 0 top
R40  23.62,34.04 180 top
R41  20.32,34.04 0 top
R42  89.66,44.45 0 top
R43  91.95,42.42 0 top
R44  93.22,40.39 0 top
R45  92.71,45.21 270 top
R46  104.9,43.18 90 top
R47  101.85,41.4 0 top
R48  102.11,39.37 0 top
R49  71.88,75.18 270 top
R50  73.91,77.47 90 top
R51  75.95,77.47 90 top
R52  71.88,78.49 90 top
R53  73.91,80.77 90 top
R54  75.95,82.55 90 top
R55  70.61,81.53 0 top
R56  71.37,92.2 180 top
R57  74.93,90.93 90 top
R58  76.96,91.19 90 top
R60  32.26,34.04 180 top
R61  28.96,34.04 0 top
R62  90.93,30.73 0 top
R63  91.82,28.45 0 top
R64  93.98,26.67 0 top
R65  93.73,31.24 270 top
R66  105.41,27.94 90 top
R67  102.62,27.05 0 top
R68  102.62,25.15 0 top
R69  88.65,75.18 270 top
R70  90.68,77.47 90 top
R71  92.71,77.47 90 top
R72  88.65,78.49 90 top
R73  91.69,80.77 90 top
R74  93.73,82.55 90 top
R75  87.88,81.53 0 top
R76  88.65,91.19 180 top
R77  91.69,89.41 90 top
R78  93.73,89.41 90 top
R80  40.89,34.04 180 top
R81  37.59,34.04 0 top
R82  90.68,17.02 0 top
R83  90.42,14.99 0 top
R84  92.71,12.95 0 top
R85  93.73,17.78 270 top
R86  104.9,14.99 90 top
R87  102.11,12.45 0 top
R88  102.36,10.41 0 top
R89  104.39,73.66 270 top
R90  106.93,76.45 90 top
R91  108.97,76.2 90 top
R92  104.39,77.22 90 top
R93  106.93,80.01 90 top
R94  108.97,82.3 90 top
R95  103.38,80.01 0 top
R96  105.16,90.68 180 top
R97  108.97,90.17 90 top
R98  111,90.42 90 top
REG  10.92,16.76 0 top
TM1  49.53,61.72 0 top
TM2  34.8,58.67 90 top
TM3  98.3,52.07 270 top
TM4  63.25,85.6 0 top
TM5  96.77,36.83 270 top
TM6  79.5,86.11 0 top
TM7  97.79,23.11 270 top
TM8  96.77,85.6 0 top
TM9  96.27,9.4 270 top
TM10  112.01,85.6 0 top
U1  12.7,27.18 270 top
U2  22.1,27.18 270 top
U3  30.73,27.3 270 top
U4  39.37,27.18 270 top
U$1  71.12,1.78 90 top
U$2  48.26,9.4 0 top
U$3  74.93,10.67 270 top
U$4  49.28,48.26 0 top
U$5  42.16,63.75 90 top
U$6  33.27,51.31 180 top
U$8  98.3,59.94 0 top
U$9  55.88,86.61 90 top
U$10  97.79,44.2 0 top
U$11  71.63,86.61 90 top
U$12  98.81,29.97 0 top
U$13  88.9,86.11 90 top
U$14  98.81,16.26 0 top
U$15  104.65,85.6 90 top

### Tracks (layer width: path | path; a pad name or v marks a point on that pad's centre or on a via)
+3V3  (via drill 0.35)
  Top 0.254: U$1.3.3V 38.86,15.24 37.08,15.24 | 36.07,29.97 36.4,29.64 U4.4 | 36.07,29.97 v34.54,31.5 | 28.79,29.81 U3.4 28.79,29.81 | U1.4 9.47,29.64 v9.14,29.97 9.14,29.04 C19.1 C18.1 6.6,29.04 6.6,41.15 12.19,46.74 C5.2 C8.1 29.46,48.43 29.46,49.28 | 19.3,29.97 19.86,29.97 U2.4 | v18.8,32 18.8,30.48 19.3,29.97 | v27.43,32 27.43,31.17 28.79,29.81 | C34.1 C33.1 19.3,29.63 19.3,29.97 | C48.1 C49.1 28.79,29.72 28.79,29.81 | C63.1 C64.1 36.07,28.23 36.07,29.97 | R28.2 103.63,55.25 | 103.63,55.25 103.63,54.36 103.63,53.59 C37.2 C40.2 98.81,46.4 100,45.21 | 54.34,89.39 53.34,90.39 53.34,93.98 54.36,95 58.93,95 61.21,92.71 R38.2 63.98,88.18 64.11,88.18 64.14,88.15 C43.2 C46.1 70.08,89.39 70.09,89.39 | 54.34,89.39 U$9.8 | U$11.8 70.09,89.39 | 70.09,89.39 69.09,90.39 69.09,95.5 69.6,96.01 73.16,96.01 R58.2 78.98,92.21 83.05,88.15 C61.1 C58.2 86.11,88.15 87.1,89.14 | 87.1,89.14 85.34,90.9 85.34,93.47 86.87,95 90.93,95 93.73,92.2 R78.2 94.75,89.41 97.93,89.41 C76.1 C73.2 103.1,88.37 103.11,88.37 | 87.1,89.14 U$13.8 | 103.11,88.37 102.62,88.86 102.62,93.98 103.63,95 106.68,95 107.45,95 R98.2 114.3,88.15 114.3,76.2 110.74,72.64 | 103.11,88.37 U$15.8 | 41.19,66.55 41.19,68.07 41.19,72.09 41.15,72.14 41.66,72.64 45.21,72.64 | 45.21,72.64 45.21,68.67 R11.2 49.7,66.64 51.82,64.52 51.82,53.07 51.44,52.7 51.44,51.85 51.82,51.47 51.82,49.35 U$4.P$15 | U$6.8 30.01,49.28 29.46,49.28 | 29.46,49.28 25.4,49.28 24.89,49.78 24.89,52.83 28.96,56.9 R18.2 30.14,59.18 C9.2 C12.1 39.71,66.55 41.19,66.55 | C25.2 C22.2 100.08,61.34 U$8.8 105.66,60.92 107.74,60.92 107.95,60.71 | U$10.8 100,45.21 | 107.95,60.71 108.2,60.45 108.2,56.39 107.06,55.25 103.63,55.25
  Top 0.254: U$12.8 101.6,30.95 | 101.6,30.95 103.59,30.95 107.74,30.95 108.71,29.97 108.71,26.42 107.44,25.15 R68.2 101.1,22.61 C67.2 C70.2 101.1,17.32 101.06,17.27 | 101.6,30.95 101.36,31.19 C55.2 C52.2 103.05,36.11 103.13,36.11 103.13,38.14 R48.2 105.92,39.37 108.2,41.66 108.2,44.7 107.7,45.21 107.55,45.21 100.04,45.21 100,45.21 | R88.2 103.63,10.41 | 103.63,10.41 106.94,10.41 108.2,11.68 108.2,16.76 107.7,17.27 101.06,17.27 | U$14.8 101.06,17.27 | U$5.8 41.19,66.55 | C14.1 37.08,12.53 | 37.08,12.53 C13.1 | R31.1 56.39,76.11 C27.1 C26.1 58.51,74.17 59.94,74.17 59.94,71.63 59.18,70.87 J7.2 69.34,70.87 70.1,70.1 70.92,70.1 70.94,70.13 73.33,70.13 73.36,70.1 74.17,70.1 | R50.1 C42.1 C41.1 77.13,75.27 77.72,74.68 77.72,72.64 76.71,71.63 75.69,71.63 | 75.69,71.63 J15.2 | R70.1 C56.1 C57.1 93.38,75.27 94.49,74.17 94.49,72.14 93.47,71.12 92.46,71.12 | 92.46,71.12 J23.2 | R90.1 C72.1 C71.1 109.64,73.75 110.74,72.64 | 110.49,69.34 J31.2 106.93,68.07 103.12,68.07 101.47,69.72 90.93,69.72 | 110.49,69.34 110.74,69.6 110.74,72.64 | 54.34,89.39 53.69,89.39 C31.1 C28.2 49.28,86.75 49.28,76.71 45.21,72.64 | R1.1 77.05,13.05 U$3.8 80.39,12.57 86.87,6.1 100.58,6.1 103.63,9.14 103.63,10.41 | 74.17,70.1 74.42,70.36 75.69,71.63 | 74.17,70.1 74.22,70.1 74.25,70.13 87.35,70.13 87.76,69.72 90.93,69.72 | 90.93,69.72 91.06,69.72 92.46,71.12 | 107.95,60.71 107.95,63.25 110.49,65.79 110.49,69.34 | 37.08,15.24 37.08,12.53 | 37.08,15.24 36.07,15.24 v33.53,17.78
  Bottom 0.254: 27.43,33.02 19.3,33.02 18.8,33.02 v18.8,32 17.78,30.99 16.26,30.99 9.65,30.99 9.65,30.48 v9.14,29.97 9.14,20.32 22.29,20.32 22.69,19.91 24.28,19.91 26.42,17.78 v33.53,17.78 | 27.43,33.02 28.45,33.02 29.97,31.5 v34.54,31.5 | 27.43,33.02 v27.43,32
+5V  (via drill 0.35)
  Top 0.254: U$2.3 48.9,8.76 v49.53,9.4 | C2.2 C1.2 45.12,10.76 v45.21,10.67 | REG.3 14.06,16.17 C4.2
  Bottom 0.254: v49.53,9.4 46.99,9.4 45.72,10.67 v45.21,10.67 39.37,10.67 36.83,13.21 30.23,13.21 | REG.3 17.02,13.21 30.23,13.21 | 30.23,13.21 32.38,15.37 35.31,18.29 U$1.VIN
+12V
  Top 0.254: C3.2 7.79,16.17 REG.1 | U$4.P$19 48.13,47.57 U$4.P$17
  Bottom 0.254: REG.1 7.11,16.76 7.11,41.15 19.96,54 45.06,54 45.75,53.31 46.5,53.31 47.8,52.01 48.56,52.01 49.52,51.05 | U$4.P$14 49.59,50.98 49.52,51.05 | U$4.P$19 49.45,50.98 49.52,51.05
CANH  (via drill 0.35)
  Top 0.254: U$2.7 47.62,14.26 R39.1 45.47,14.48 43.18,16.76 v43.18,23.37
  Bottom 0.254: U$4.P$21 51.98,45.21 52.05,45.28 52.9,45.28 54.36,43.83 54.36,36.07 43.18,24.89 v43.18,23.37
CANL  (via drill 0.35)
  Top 0.254: U$2.6 48.9,14.26 R39.2 48.26,15.33 48.26,19.81 v44.7,23.37
  Bottom 0.254: v44.7,23.37 44.7,25.4 55.37,36.07 55.37,46.23 54.37,47.23 54,47.23 53.99,47.24 53.85,47.24 53.2,47.89 49.66,47.89 U$4.P$20
CS1
  Top 0.254: U1.6 12.06,19.94 12.7,19.3 32,19.3 32.51,18.8 32.51,17.27 34.54,15.24 34.54,2.54 35.56,1.52 35.94,1.14 55.24,1.14 U$1.D7(RX3)
CS2  (via drill 0.35)
  Top 0.254: U2.6 21.34,24.59 v21.34,21.84
  Bottom 0.254: U$1.D8(TX3) 59.44,3.3 59.44,11.18 57.4,13.21 50.8,13.21 47.75,16.26 38.61,16.26 38.1,16.76 38.1,19.81 37.59,20.32 22.86,20.32 v21.34,21.84
CS3  (via drill 0.35)
  Top 0.254: U3.6 30.1,21.97 v29.97,21.84
  Bottom 0.254: v29.97,21.84 30.99,20.83 39.12,20.83 39.62,20.32 47.75,20.32 48.26,19.81 48.26,17.27 49.78,15.75 50.29,15.75 52.32,13.72 60.45,13.72 62.23,11.94 U$1.D9(RX2)
CS4  (via drill 0.35)
  Top 0.254: U4.6 v38.73,21.97
  Bottom 0.254: U$1.D10(TX2) 63.5,4.32 63.5,13.21 62.23,14.48 53.34,14.48 50.8,17.02 50.8,19.56 49.53,20.83 39.88,20.83 v38.73,21.97
GND  (via drill 0.35)
  Top 0.254: U$2.2 47.62,7.49 v45.72,9.4 | U$2.8 46.35,8.76 v45.72,9.4 | R4.1 R3.2 72.6,7.07 | v55.88,10.67 66.46,10.67 70.27,14.48 R2.2 | 72.6,7.07 72.33,7.34 U$3.4 | 72.6,7.07 54.82,7.07 v53.34,5.59 | v42.67,30.48 41.55,29.36 U4.1 | 16.26,29.97 14.94,29.97 U1.1 | 16.26,29.97 16.76,29.97 v17.78,29.97 | 16.26,29.97 16.26,28.61 C33.2 C34.2 16.09,26.59 15.84,26.84 C19.2 | C18.2 C19.2 | C19.2 8.64,19.05 REG.2 10.92,12.45 11.18,12.19 | U3.1 33.33,29.77 v34.04,30.48 34.2,30.31 C64.2 C63.2 | C48.2 C49.2 25.4,28.36 v25.4,29.97 25.07,29.64 U2.1 | 96.09,56.39 96.09,54.9 LT1790B2.A 96.64,54.36 97.03,54.36 98.04,53.34 98.04,50.05 C37.1 C40.1 96.77,45.98 v97.54,45.21 | 96.09,56.39 96.09,57.4 96.09,57.79 | 96.09,57.79 U$8.4 | C24.1 96.09,56.39 | 96,42.67 C39.1 96,39.5 LT1790B4.A 96.52,38.72 96.52,35.56 97.03,35.05 98.67,35.05 C52.1 C55.1 99.31,31.25 v99.57,30.99 | 96,42.67 96,42.8 U$10.4 | 97.02,28.45 C54.1 97.02,25.78 LT1790B6.A 97.54,25.01 97.54,21.84 98.04,21.34 98.54,21.34 C67.1 C70.1 99.05,17.79 v99.57,17.27 | 97.02,28.45 97.02,28.57 U$12.4 | LT1790B8.A 96.64,13.34 C69.1 96.51,14.73 | 96.51,14.73 96.51,15.2 U$14.4 | 58.04,85.21 58.67,85.84 C30.1 59.82,84.95 LT1790B3.A 65.53,84.95 | 58.04,85.21 57.23,84.4 U$9.4 | 73.53,85.33 C45.1 75.06,85.46 LT1790B5.A 77.6,86.1 81.79,86.1 | 73.53,85.33 U$11.4 | 90.3,84.32 C60.1 92.33,84.95 LT1790B7.A 93.86,85.08 99.06,85.08 | 90.3,84.32 U$13.4 | 106.94,84.07 C75.1 108.33,84.7 LT1790B9.A 109.61,84.84 111.76,84.84 112.02,84.58 112.02,76.97 v110.24,75.18 109.13,75.18 R91.1 | 106.94,84.07 106.26,83.39 U$15.4 | C11.1 35.14,55.83 LT1790B1.A 35.44,62.79 C9.1 C12.2 40.04,64.52 v41.15,64.52
  Top 0.254: C11.1 35.14,52.63 U$6.4 | C2.1 C1.1 45.38,9.06 v45.72,9.4 | C4.1 11.18,12.19 | 11.18,12.19 C3.1 | C5.1 C8.2 32.51,48.26 v33.02,48.77 | C11.1 36.16,53.34 v36.58,53.34 | v44.2,59.94 44.2,60.49 U$5.4 43.3,61.38 C7.1 45.26,61.33 LT1790B.A | C25.1 C22.1 96.9,62.87 v96.52,62.48 | v96.9,57.79 96.09,57.79 | v97.03,43.18 96.52,42.67 96,42.67 | v98.04,28.45 97.02,28.45 | v98.04,14.74 v98.03,14.73 96.51,14.73 | v70.61,86.87 69.84,86.1 C46.2 C43.1 65.91,84.95 65.53,84.95 | v73.15,86.36 73.53,85.98 73.53,85.33 | v87.88,86.36 87.62,86.1 C58.1 C61.2 81.79,86.1 | v90.42,85.34 90.42,84.44 90.3,84.32 | v103.63,85.85 102.62,85.85 C73.1 C76.2 99.06,85.08 | v106.17,84.84 106.94,84.07 | C14.2 37.08,10.83 | 37.08,10.83 C13.2 | U$1.GND 36.83,10.58 37.08,10.83 | R30.2 54.86,74.08 | 54.86,74.08 55.37,74.08 C27.2 C26.2 58.33,72.64 v59.29,72.64 | R32.1 59.27,76.37 v59.94,75.69 65.53,81.28 65.53,84.95 | R49.2 72.64,73.57 C42.2 C41.2 76.03,73.66 v77.07,73.66 | R51.1 76.03,76.71 v77.22,76.71 81.79,81.28 81.79,86.1 | R69.2 89.41,73.57 C56.2 C57.2 92.71,73.28 v93.6,72.39 | R71.1 93.13,76.2 v93.98,76.2 99.06,81.28 99.06,85.08 | R89.2 104.48,72.81 105.24,72.05 C72.2 C71.2 109.89,71.12 v110.09,71.12 | C28.1 C31.2 54.22,86.22 v54.36,86.36 | U$4.P$3 52.48,51.92 U$4.P$2 52.48,61.11 v52.83,61.47 | v54.25,72.9 54.86,73.51 54.86,74.08 | v57.4,85.85 58.04,85.21
  Bottom 0.254: 39.37,5.59 v53.34,5.59 55.88,8.13 v55.88,10.67 | 39.37,5.59 U$1.GND 21.34,3.05 10.92,13.46 REG.2 | v45.72,9.4 43.18,9.4 39.37,5.59 | v17.78,29.97 23.88,29.97 24.38,29.97 v25.4,29.97 32,29.97 33.53,29.97 33.53,30.48 v34.04,30.48 36.07,30.48 | 36.07,30.48 v42.67,30.48 | v36.58,53.34 35.56,53.34 33.02,50.8 v33.02,48.77 33.02,46.23 26.42,39.62 26.42,35.56 27.94,34.04 33.02,34.04 36.07,30.99 36.07,30.48 | 44.2,62.48 43.69,62.99 41.66,62.99 41.15,63.5 v41.15,64.52 | 44.2,62.48 v44.2,59.94 | v96.9,57.79 96.9,62.48 v96.52,62.48 96.52,69.09 93.66,71.95 93.66,72.45 | v97.54,45.21 97.54,43.69 v97.03,43.18 | v99.57,30.99 98.04,29.46 v98.04,28.45 | v99.57,17.27 98.04,15.75 v98.04,14.74 | v70.61,86.87 72.64,86.87 v73.15,86.36 | v87.88,86.36 89.41,86.36 v90.42,85.34 | v103.63,85.85 105.16,85.85 v106.17,84.84 | v59.94,75.69 59.29,75.03 v59.29,72.64 | v77.07,73.66 77.22,73.81 v77.22,76.71 | v93.6,72.39 93.66,72.45 | 93.66,72.45 93.98,72.77 v93.98,76.2 | v110.09,71.12 110.24,71.27 v110.24,75.18 | v54.36,86.36 56.9,86.36 v57.4,85.85 | v52.83,61.47 52.07,62.23 51.82,62.48 | 51.82,62.48 44.2,62.48 | 51.82,62.48 51.82,71.48 53.24,72.9 v54.25,72.9
INB-
  Top 0.254: R10.2 44.2,67.4 44.2,67.56 | 44.2,67.56 44.2,68.16 R9.1 C6.1 | U$5.6 42.64,66.12 42.64,66.78 43.43,67.56 44.2,67.56
INB-1
  Top 0.254: R17.2 28.45,53.43 R16.1 | R16.1 C10.1 | U$6.6 28.97,51.63 R16.1
INB-2
  Top 0.254: U$8.6 102.43,59.62 103.39,58.66 R27.2 103.63,57.27 R26.1 C23.1
INB-3
  Top 0.254: U$9.6 56.2,89.98 56.91,90.68 R36.1 | R36.1 59.17,91.69 R37.2 | C29.1 R36.1
INB-4
  Top 0.254: R47.2 | R47.2 102.62,41.66 102.62,43.69 102.43,43.87 U$10.6 | R47.2 103.62,42.16 R46.1 C38.1
INB-5
  Top 0.254: R57.2 72.64,91.96 | 72.64,91.96 R56.1 C44.1 | U$11.6 71.95,91.27 72.64,91.96
INB-6
  Top 0.254: U$12.6 102.94,29.65 103.64,28.95 103.64,28.45 R67.2 103.78,26.91 105.66,26.91 | R66.1 105.66,26.91 | 105.66,26.91 C53.1
INB-7
  Top 0.254: R77.2 91.06,91.06 90.94,91.19 R76.1 | C59.1 R76.1 | U$13.6 89.22,90.74 R76.1
INB-8
  Top 0.254: R87.2 103.13,13.72 | 103.13,13.72 103.13,15.23 102.43,15.93 U$14.6 | 103.13,13.72 104.66,13.72 R86.1 C68.1
INB-9
  Top 0.254: R97.2 106.7,91.19 R96.1 | R96.1 C74.1 | U$15.6 104.97,89.47 R96.1
MISO  (via drill 0.35)
  Top 0.254: 31.75,20.83 31.37,21.21 U3.7 | 31.75,20.83 39.12,20.83 39.12,21.08 v40.01,21.97 U4.7 | 23.37,20.83 22.73,21.46 U2.7 | 23.37,20.83 31.75,20.83 | 23.37,20.83 13.97,20.83 13.34,21.46 U1.7 | v64.77,9.4 54.61,9.4 50.8,13.21 50.8,20.83 v50.29,21.34
  Bottom 0.254: v64.77,9.4 69.85,4.32 U$1.D12 | v50.29,21.34 40.64,21.34 v40.01,21.97
N$1
  Top 0.254: U$2.4 50.16,3.68 U$1.D4(CANRX)
N$2
  Top 0.254: U1.2 13.21,29.77 13.21,32 12.79,32.42 C17.1 12.61,32.69 R20.2
N$3
  Top 0.254: U$2.1 46.35,3.68 U$1.D3(CANTX)
N$4
  Top 0.254: R2.1 R1.2 74.93,14.06 74.93,10.67 | 74.93,10.67 75.56,10.03 U$3.6 | U$3.2 74.3,11.3 74.93,10.67
N$5
  Top 0.254: U$5.2 41.84,59.09 | 41.84,59.09 R8.2 | R5.2 41.91,59.02 41.84,59.09
N$6
  Top 0.254: U1.3 12.06,31.11 11.09,32.09 C17.2 11.01,32.59 R21.2
N$7
  Top 0.254: R21.1 10.16,34.89 J2.2
N$8
  Top 0.254: R7.1 45.9,58 R6.2 43.18,58.76 43.18,59.94 42.49,60.64 U$5.3
N$9
  Top 0.254: TM1.2 47.08,63.22 LT1790B.C | R10.1 C7.2 45.26,63.13 LT1790B.C | R11.1 46.99,64.68 LT1790B.C
N$10
  Top 0.254: R7.2 48.41,59.78 TM1.1
N$11
  Top 0.254: U$6.2 37.5,50.98 R15.2 37.63,50.93 R12.2
N$12
  Top 0.254: U$6.3 36.89,51.63 38.09,52.83 R13.2 38.44,52.91 R14.1
N$13
  Top 0.254: TM2.2 33.3,56.9 | 33.3,56.9 33.3,56.48 LT1790B1.C 33.64,54.56 C11.2 32.09,54.36 R17.1 | R18.1 33.3,56.9
N$14
  Top 0.254: R14.2 36.62,54.98 TM2.1
N$15
  Top 0.254: R20.1 13.84,34.51 J1.2
N$16
  Top 0.254: U$8.2 93.55,60.27 R25.2 90.31,59.43 R22.2
N$17
  Top 0.254: U$8.3 95.18,59.62 94.5,58.94 R23.2 94.5,56.41 R24.1
N$18
  Top 0.254: R27.1 R28.1 99.92,55.25 99.8,55.37 | 99.8,55.37 TM3.2 99.8,52.99 LT1790B2.C | 99.8,55.37 99.32,55.85 C24.2
N$19
  Top 0.254: TM3.1 94.93,54.61 R24.2
N$21
  Top 0.254: J6.2 R22.1
N$22
  Top 0.254: R33.1 56.9,78.32 R31.2 R32.2
N$23
  Top 0.254: R29.1 R30.1 53.34,74.51 53.34,71.75 J8.2
N$24
  Top 0.254: U2.2 22.73,32.47 C32.1 22.77,32.59 R40.2
N$25
  Top 0.254: J5.2 86.61,57.4 92.19,57.4 R23.1
N$26
  Top 0.254: U$9.2 55.55,82.47 R35.2 54.61,81.52 R29.2
N$27
  Top 0.254: U$9.3 56.2,82.49 R33.2 58.66,81.8 R34.1
N$28
  Top 0.254: TM4.2 62.9,86.75 60.96,86.75 | 60.96,86.75 LT1790B3.C | 60.96,86.75 60.07,86.75 C30.2 59.18,88.15 R37.1 60.45,89.65 R38.1
N$29
  Top 0.254: R34.2 62.19,83.83 TM4.1
N$30
  Top 0.254: U2.3 21.46,32.04 C32.2 21.17,32.69 R41.2
N$31
  Top 0.254: R41.1 19.43,34.08 J10.2
N$32
  Top 0.254: R40.1 24.47,34.96 J9.2
N$33
  Top 0.254: U$10.2 93.04,44.52 R45.2 90.95,44.19 R42.2
N$34
  Top 0.254: U$10.3 94.43,43.87 R43.2 92.19,41.64 R44.1
N$35
  Top 0.254: TM5.2 98.27,38.77 LT1790B4.C 97.67,41.02 C39.2 R47.1 101.08,41.15 R48.1
N$36
  Top 0.254: R44.2 94.24,38.54 TM5.1
N$37
  Top 0.254: R51.2 R50.2 R53.1
N$38
  Top 0.254: R52.1 R49.1 70.61,74.76 70.61,73.15 J16.2
N$39
  Top 0.254: J14.2 R42.1
N$40
  Top 0.254: J13.2 89.53,41.02 R43.1
N$41
  Top 0.254: R55.2 71.5,81.66 | 71.5,81.66 71.3,81.87 U$11.2 | R52.2 71.88,81.29 71.5,81.66
N$42
  Top 0.254: U$11.3 71.95,82.99 72.14,82.8 72.91,82.8 R53.2 75.67,81.8 R54.1
N$43
  Top 0.254: TM6.2 79.16,87.26 LT1790B5.C 76.84,87.38 C45.2 R57.1 76.71,89.91 R58.1
N$44
  Top 0.254: R54.2 77.8,83.57 TM6.1
N$45
  Top 0.254: U3.2 31.37,32.22 C47.1 31.33,33.96 R60.2
N$46
  Top 0.254: U3.3 30.1,31.79 C47.2 29.63,33.86 R61.2
N$47
  Top 0.254: R61.1 28.11,35.73 J18.2
N$48
  Top 0.254: R60.1 33.11,35.6 J17.2
N$49
  Top 0.254: R65.2 | R65.2 93.21,30.73 R62.2 | U$12.2 96.52,30.22 R65.2
N$50
  Top 0.254: R63.2 92.91,28.39 | 92.91,28.39 92.95,28.34 R64.1 | U$12.3 95.18,29.65 93.92,28.39 92.91,28.39
N$51
  Top 0.254: TM7.2 99.29,25.05 LT1790B6.C 98.69,26.8 C54.2 101.46,27.18 R67.1 R68.1
N$52
  Top 0.254: R64.2 95,25.07 TM7.1
N$53
  Top 0.254: R70.2 91.44,78.32 | 91.44,78.32 R71.2 | R73.1 91.69,78.57 91.44,78.32
N$54
  Top 0.254: R69.1 88.65,76.71 | 88.65,76.71 R72.1 | J24.2 88.9,72.14 87.38,73.66 87.38,75.18 88.65,76.45 88.65,76.71
N$55
  Top 0.254: J22.2 R62.1
N$56
  Top 0.254: J21.2 89.27,26.92 R63.1
N$57
  Top 0.254: U$13.2 88.58,81.87 R75.2 88.65,81.27 R72.2
N$58
  Top 0.254: R74.1 93.45,81.8 91.95,81.8 | 91.95,81.8 R73.2 | U$13.3 89.22,82.99 89.41,82.8 90.94,82.8 91.95,81.8
N$59
  Top 0.254: C60.2 93.34,86.37 93.4,86.43 | 93.4,86.43 LT1790B7.C R78.1 R77.1 | TM8.2 94.07,87.1 93.4,86.43
N$60
  Top 0.254: R74.2 95.58,83.57 TM8.1
N$61
  Top 0.254: U4.2 40.01,32.04 C62.1 40.04,32.43 R80.2
N$62
  Top 0.254: U4.3 38.73,32.04 C62.2 38.52,33.96 R81.2
N$63
  Top 0.254: R81.1 36.74,35.6 J26.2
N$64
  Top 0.254: R80.1 41.74,35.6 J25.2
N$65
  Top 0.254: U$14.2 93.9,16.58 R85.2 91.97,16.75 R82.2
N$66
  Top 0.254: R84.1 91.45,13.19 R83.2 93.8,14.99 94.75,15.93 U$14.3
N$67
  Top 0.254: TM9.2 98.44,10.07 LT1790B8.C 98.56,12.06 C69.2 100.07,13.46 100.96,12.57 | 100.96,12.57 R87.1 | R88.1 101.34,12.19 100.96,12.57
N$68
  Top 0.254: TM9.1 94.44,12.25 R84.2
N$69
  Top 0.254: R91.2 108.71,77.3 R90.2 R93.1
N$70
  Top 0.254: R89.1 104.39,74.68 | 104.39,74.68 R92.1 | 104.39,74.68 104.14,74.68 103.12,73.66 103.12,70.87 J32.2
N$71
  Top 0.254: R82.1 89.4,17.27 J30.2
N$72
  Top 0.254: R83.1 88.13,13.72 J29.2
N$73
  Top 0.254: U$15.2 104.32,80.09 R95.2 R92.2
N$74
  Top 0.254: U$15.3 104.97,81.97 105.91,81.03 R93.2 107.17,81.27 R94.1
N$75
  Top 0.254: TM10.2 111.77,86.86 | 111.77,86.86 111.41,86.5 LT1790B9.C 108.84,87.13 C75.2 | R98.1 111.12,89.28 | 111.12,89.28 111.77,88.62 111.77,86.86 | R97.1 110.99,89.14 111.12,89.28
N$76
  Top 0.254: R94.2 109.74,83.32 110.24,83.82 110.97,83.82 TM10.1
OUTA
  Top 0.254: R8.1 40.3,59.44 41.19,60.33 U$5.1 41.19,63.03 43.14,64.98 U$5.5
OUTB
  Top 0.254: R15.1 36.45,50.33 U$6.1 34.5,50.33 32.55,52.28 U$6.5
OUTC
  Top 0.254: R25.1 95.54,61.47 96.03,60.98 | 96.03,60.98 U$8.1 | U$8.5 99.53,58.97 97.54,60.96 96.05,60.96 96.03,60.98
OUTD
  Top 0.254: R35.1 53.08,82.58 U$9.1 54.91,85.38 56.85,87.33 U$9.5
OUTE
  Top 0.254: R45.1 94.48,46.24 95.55,45.17 U$10.1 95.73,45.02 96.39,45.02 98.19,43.22 U$10.5
OUTF
  Top 0.254: U$11.5 72.6,87.84 70.65,85.89 U$11.1 69.59,83.34 R55.1
OUTG
  Top 0.254: R65.1 95.05,30.95 U$12.1 97.58,30.95 98.55,29.97 98.55,29.46 99.02,29 U$12.5
OUTH
  Top 0.254: U$13.1 87.87,83.84 | 87.87,83.84 86.86,82.83 R75.1 | U$13.5 89.88,86.83 87.87,84.82 87.87,83.84
OUTI
  Top 0.254: R85.1 95.02,18.8 U$14.1 97.58,17.23 99.53,15.28 U$14.5
OUTJ
  Top 0.254: R95.1 103.67,81.33 U$15.1 103.67,84.37 105.62,86.32 U$15.5
SCK  (via drill 0.35)
  Top 0.254: v10.79,22.73 U1.5 | v20.19,22.73 U2.5 | U3.5 28.83,22.99 v28.57,22.73 | v37.47,22.73 U4.5
  Bottom 0.254: v10.79,22.73 v20.19,22.73 v28.57,22.73 v37.47,22.73 40.64,22.73 41.27,22.1 50.8,22.1 53.34,19.56 53.34,17.02 54.61,15.75 68.58,15.75 69.85,17.02 U$1.D13
SG1_V+
  Top 0.254: U$4.P$13 46.53,54.86 42.08,54.86 R5.1
SG1_V-
  Top 0.254: R6.1 47.38,56.3 U$4.P$1
SG1_VOUT  (via drill 0.35)
  Top 0.254: U$5.7 41.84,68.34 R9.2 C6.2 42.16,70.7 v42.16,71.88 | v12.7,6.1 22.35,6.1 29.97,13.72 33.02,13.72 v33.53,14.22 | U$1.A8 46.23,17.53 v46.23,15.24
  Bottom 0.254: v42.16,71.88 33.78,71.88 3.05,41.15 3.05,11.68 8.64,6.1 v12.7,6.1 | v46.23,15.24 45.21,14.22 v33.53,14.22
SG2_V+
  Top 0.254: R12.1 44.22,50.93 U$4.P$22
SG2_V-
  Top 0.254: R13.1 45.52,52.83 U$4.P$12
SG2_VOUT
  Top 0.254: C10.2 R16.2 28.97,50.98 U$6.7
SNR1
  Bottom 0.254: U$1.A5 54.61,19.81 51.31,23.11 J34.2 J35.2
SNR1-SG-VOUT  (via drill 0.35)
  Top 0.254: U$9.7 55.55,90.22 v55.42,90.35 55.05,90.73 55.05,91.5 R36.2 C29.2 | J35.1 77.22,55.63 v77.22,56.39
  Bottom 0.254: v77.22,56.39 63.5,70.1 63.5,82.28 v55.42,90.35
SNR1-WB-VOUT  (via drill 0.35)
  Top 0.254: U$8.7 103.63,60.27 | 103.63,60.27 104.08,60.27 R26.2 C23.2 | J34.1 57.4,32 71.12,32 80.26,41.15 80.26,47.24 88.39,55.37 v90.42,55.37 | v103.63,60.26 103.63,60.27
  Bottom 0.254: v90.42,55.37 98.74,55.37 v103.63,60.26
SNR2
  Bottom 0.254: U$1.A4 57.15,23.11 56.9,23.11 | 56.9,23.11 55.12,23.11 J42.2 | 56.9,23.11 58.42,23.11 J43.2
SNR2-SG-VOUT  (via drill 0.35)
  Top 0.254: 71.11,91.44 R56.2 C44.2 | 71.11,91.44 71.3,91.25 U$11.7 | v61.98,34.04 78.23,50.29 v78.23,55.88 | v70.1,90.42 71.11,91.44
  Bottom 0.254: v61.98,34.04 54.86,26.92 J42.1 | v78.23,55.88 78.23,58.93 69.95,67.21 69.95,87.14 70.1,87.29 v70.1,90.42
SNR2-WB-VOUT  (via drill 0.35)
  Top 0.254: U$10.7 103.63,44.52 | 103.63,44.52 104.59,44.52 R46.2 C38.2 | J43.1 62.74,29.97 78.23,29.97 86.36,38.1 v92.46,38.1 | v103.63,43.18 103.63,44.52
  Bottom 0.254: v92.46,38.1 98.55,38.1 v103.63,43.18
SNR3
  Bottom 0.254: J37.2 64.77,23.37 J38.2 59.69,20.83 U$1.A3
SNR3-SG-VOUT  (via drill 0.35)
  Top 0.254: v79.25,56.9 79.25,48.77 64.01,33.53 v64.01,33.02 | v86.36,92.46 87.12,93.22 C59.2 R76.2 88.58,90.23 U$13.7
  Bottom 0.254: J38.1 62.23,30.73 64.26,32.77 v64.01,33.02 | v79.25,56.9 79.25,71.63 84.84,77.22 84.84,90.93 v86.36,92.46
SNR3-WB-VOUT
  Top 0.254: U$12.7 101.09,30.3 | 101.09,30.3 104.08,30.3 R66.2 C53.2 | J37.1 68.07,27.94 78.23,27.94 83.82,33.53 96.01,33.53 99.24,30.3 101.09,30.3
SNR4
  Bottom 0.254: U$1.A2 62.23,20.07 64.01,21.84 68.07,21.84 J41.2 J40.2
SNR4-SG-VOUT  (via drill 0.35)
  Top 0.254: U$15.7 104.32,90.49 R96.2 C74.2 104.13,94.22 v104.14,94.23 | v80.26,57.91 80.26,48.26 71.12,39.12 71.12,38.61 v65.53,33.02
  Bottom 0.254: v80.26,57.91 80.26,70.36 v104.14,94.23 | v65.53,33.02 69.09,29.46 69.09,26.42 J41.1
SNR4-WB-VOUT
  Top 0.254: C68.2 R86.2 104.33,16.58 U$14.7 99.24,16.58 95,20.83 83.82,20.83 78.74,25.91 J40.1
SRN1-1  (via drill 0.35)
  Top 0.254: J8.1 54.23,63.12 v56.39,60.96 56.39,50.22 U$4.P$4 53.05,48.26 52.68,47.89 51.17,47.89 49.39,49.67 49.39,51.19 48.56,52.01 47.63,52.01 45.08,49.46 43.37,49.46 38.61,44.7 13.21,44.7 10.16,41.66 J2.1
  Bottom 0.254: v56.39,60.96 70.87,60.96 77.47,54.36 79.5,54.36 81.03,55.88 81.03,57.91 J6.1
SRN1-2  (via drill 0.35)
  Top 0.254: J7.1 57.91,67.94 v57.91,59.94 57.91,49.28 54.66,46.03 U$4.P$5 | J1.1 13.84,42.29 15.24,43.69 39.12,43.69 v42.16,46.74
  Bottom 0.254: v42.16,46.74 43.69,46.74 44.18,47.23 46.21,47.23 46.74,47.75 47.24,47.75 48.53,46.47 50.02,46.47 50.94,47.39 52.53,47.39 U$4.P$5 | v57.91,59.94 70.1,59.94 77.53,53.34 80.01,53.34 J5.1
SRN2-1  (via drill 0.35)
  Top 0.254: U$4.P$6 54.91,44.25 v69.6,58.93 72.14,61.47 J16.1 | v42.16,45.21 39.62,42.67 21.84,42.67 19.43,40.26 J10.1
  Bottom 0.254: v69.6,58.93 81.79,46.74 J14.1 | U$4.P$6 51.36,44.25 51.31,44.2 50.8,44.7 50.23,44.7 49.7,44.18 48.85,44.18 48.32,44.7 47.24,44.7 46.67,45.28 45.37,45.28 45.08,44.99 44.23,44.99 44.01,45.21 v42.16,45.21
SRN2-2  (via drill 0.35)
  Top 0.254: U$4.P$7 52.01,43.26 52.05,43.21 55.41,43.21 v69.6,57.4 75.44,63.25 J15.1 | J9.1 23.11,40.39 24.38,41.66 39.62,41.66 v42.16,44.2
  Bottom 0.254: v69.6,57.4 77.22,49.78 77.22,45.59 J13.1 | v42.16,44.2 44.2,42.16 49.78,42.16 50.42,42.8 U$4.P$7
SRN3-1  (via drill 0.35)
  Top 0.254: J24.1 88.39,68.07 82.3,68.07 v69.6,55.37 55.88,41.66 v50.29,41.66 49.73,41.66 U$4.P$8
  Bottom 0.254: v69.6,55.37 75.69,49.28 75.69,38.86 J22.1 | v50.29,41.66 43.69,41.66 42.16,43.18 33.02,43.18 J18.1
SRN3-2  (via drill 0.35)
  Top 0.254: U$4.P$9 46.08,43.33 48.77,40.64 v51.31,40.64 56.39,40.64 v69.6,53.85 81.79,66.04 89.66,66.04 J23.1
  Bottom 0.254: v69.6,53.85 74.17,49.28 74.17,36.58 J21.1 | v51.31,40.64 49.78,40.64 49.28,41.15 43.62,41.15 42.13,42.64 35.91,42.64 J17.1
SRN4-1  (via drill 0.35)
  Top 0.254: J32.1 102.87,66.8 100.58,69.09 96.52,69.09 92.46,65.02 82.3,65.02 75.18,57.91 v69.34,52.07 56.9,39.62 v51.31,39.62 47.75,39.62 | 47.75,39.62 47.24,39.62 44.65,42.22 | 44.65,42.22 U$4.P$10 | 44.65,42.22 | 47.75,39.62
  Bottom 0.254: J30.1 81.28,19.56 81.28,26.42 72.64,35.05 72.64,48.77 v69.34,52.07 | v51.31,39.62 44.2,39.62 42.16,41.66 38.61,41.66 37.59,40.64 J26.1
SRN4-2  (via drill 0.35)
  Top 0.254: U$4.P$11 43.18,47.32 43.18,41.66 | J31.1 105.92,64.52 104.14,64.52 102.62,66.04 96.01,66.04 93.98,64.01 83.31,64.01 v69.6,50.29 57.91,38.61 46.23,38.61 43.18,41.66 | 43.18,41.66 40.89,39.37 J25.1
  Bottom 0.254: J29.1 80.26,17.02 80.26,24.89 71.12,34.04 71.12,48.77 v69.6,50.29
WS1
  Top 0.254: U$1.D5 52.07,7.49 64.71,7.49 69.79,12.57 U$3.1
WS1_OUT  (via drill 0.35)
  Top 0.254: U$3.3 74.3,10.03 v74.68,9.65 74.93,9.4 74.93,6.86 R3.1
  Bottom 0.254: U$4.P$18 49.43,48.92 50.29,49.78 51.65,49.78 51.82,49.95 52.98,49.95 53.64,49.29 54.86,49.29 55.47,48.69 55.47,48.67 76.22,27.91 76.22,11.2 v74.68,9.65
WS2
  Top 0.254: U$3.7 79.38,11.3 80.01,10.67 80.01,4.32 78.74,3.05 73.66,3.05 71.12,5.59 57.15,5.59 U$1.D6
WS2_OUT  (via drill 0.35)
  Top 0.254: U$3.5 77.47,8.7 77.47,7.62 | 77.47,7.62 R4.2 | 77.47,7.62 v76.2,7.62 | v56.39,46.74 54.36,44.7 53.48,44.7 51.83,46.36 U$4.P$16
  Bottom 0.254: v76.2,7.62 74.68,7.62 73.66,8.64 73.66,10.16 75.18,11.68 75.18,27.94 v56.39,46.74

### Text on the board
tNames: SINGLE STRAIN GAUGE | 1 2 3 4 | PERMANENT STRAIN GAUGES | THERMOCOUPLES | 1 2 3 4 | STRAIN GAUGE TYPE / (SINGLE|FULL) | 1 2 3 4 | FULL STRAIN GAUGES | 1 2 3 4 | WHEEL SPEED